# EasyEDA Pro project ProPrj_#第九届立创电赛#粮食水分仪_2024-10-15.epro

# Schematic 粮食水分仪主板
Board Name: 粮食水分仪主板; Create Date: 2024-09-28; Page Name: eeeeee; Project Name: #第九届立创电赛#粮食水分仪; Schematic Name: 粮食水分仪主板; Update Date: 2024-09-28; Company: 嘉立创EDA; Page Size: A2; Version: V1.0
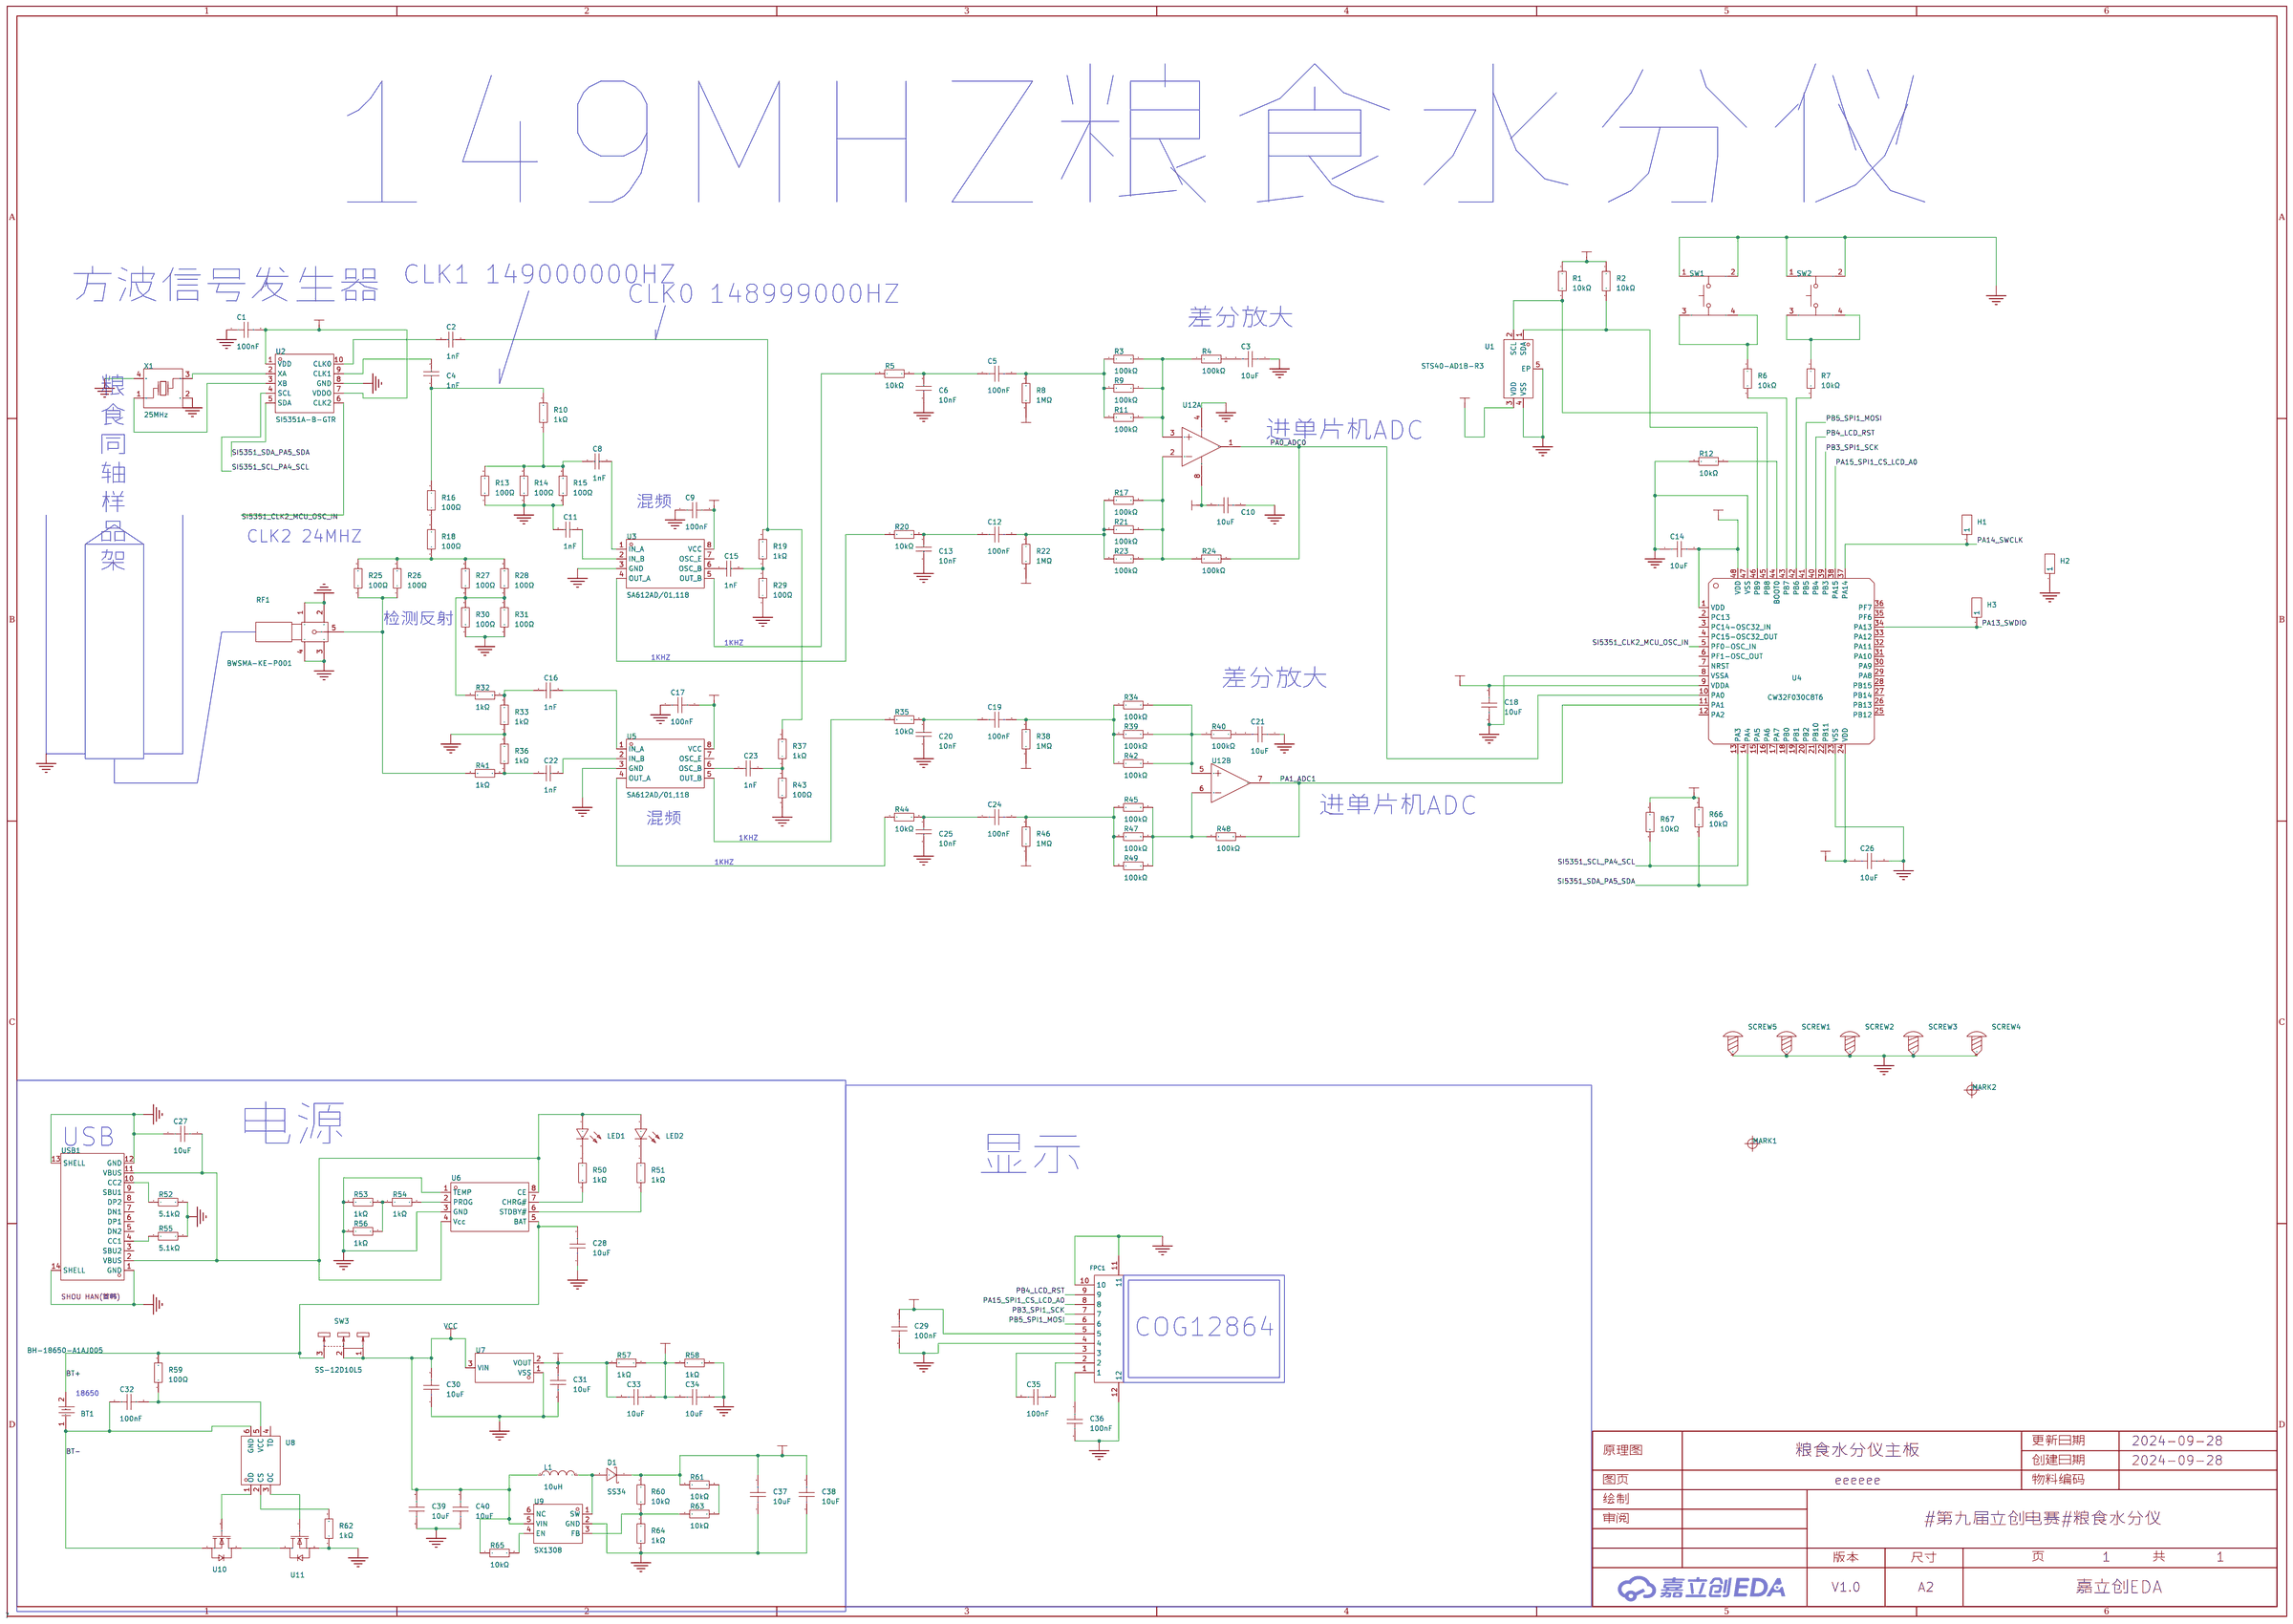
[diagram p0: schematic sheet]

## Parts
BT1  BH-18650-A1AJ005  [BAT-TH_BH-18650-A1AJ005]
C1  100nF  [C0603]
C2  1nF  [C0603]
C3  10uF  [C0603]
C4  1nF  [C0603]
C5  100nF  [C0603]
C6  10nF  [C0603]
C8  1nF  [C0603]
C9  100nF  [C0603]
C10  10uF  [C0603]
C11  1nF  [C0603]
C12  100nF  [C0603]
C13  10nF  [C0603]
C14  10uF  [C0603]
C15  1nF  [C0603]
C16  1nF  [C0603]
C17  100nF  [C0603]
C18  10uF  [C0603]
C19  100nF  [C0603]
C20  10nF  [C0603]
C21  10uF  [C0603]
C22  1nF  [C0603]
C23  1nF  [C0603]
C24  100nF  [C0603]
C25  10nF  [C0603]
C26  10uF  [C0603]
C27  10uF  [C0603]
C28  10uF  [C0603]
C29  100nF  [C0603]
C30  10uF  [C0603]
C31  10uF  [C0603]
C32  100nF  [C0603]
C33  10uF  [C0603]
C34  10uF  [C0603]
C35  100nF  [C0603]
C36  100nF  [C0603]
C37  10uF  [C0603]
C38  10uF  [C0603]
C39  10uF  [C0603]
C40  10uF  [C0603]
D1  SS34  [SMA_L4.3-W2.6-LS5.2-RD]
FPC1  -  [FPC-SMD_10P-P1.0_FGS-XJ-H2.0]
H1  -  [HDR-TH_1P-V-M_XKB_X4611WV-01I-C28D40]
H2  -  [HDR-TH_1P-V-M_XKB_X4611WV-01I-C28D40]
H3  -  [HDR-TH_1P-V-M_XKB_X4611WV-01I-C28D40]
L1  10uH  [IND-SMD_L6.0-W6.0_SWPA6045S]
LED1  204-10SURD/S530-A3-L  [LED-TH_BD3.0-P2.54-FD]
LED2  204-10SURD/S530-A3-L  [LED-TH_BD3.0-P2.54-FD]
MARK1  -  [Mark-Point-1mm]  (no BOM)
MARK2  -  [Mark-Point-1mm]  (no BOM)
R1  10kΩ  [R0603]
R2  10kΩ  [R0603]
R3  100kΩ  [R0603]
R4  100kΩ  [R0603]
R5  10kΩ  [R0603]
R6  10kΩ  [R0603]
R7  10kΩ  [R0603]
R8  1MΩ  [R0603]
R9  100kΩ  [R0603]
R10  1kΩ  [R0603]
R11  100kΩ  [R0603]
R12  10kΩ  [R0603]
R13  100Ω  [R0603]
R14  100Ω  [R0603]
R15  100Ω  [R0603]
R16  100Ω  [R0603]
R17  100kΩ  [R0603]
R18  100Ω  [R0603]
R19  1kΩ  [R0603]
R20  10kΩ  [R0603]
R21  100kΩ  [R0603]
R22  1MΩ  [R0603]
R23  100kΩ  [R0603]
R24  100kΩ  [R0603]
R25  100Ω  [R0603]
R26  100Ω  [R0603]
R27  100Ω  [R0603]
R28  100Ω  [R0603]
R29  100Ω  [R0603]
R30  100Ω  [R0603]
R31  100Ω  [R0603]
R32  1kΩ  [R0603]
R33  1kΩ  [R0603]
R34  100kΩ  [R0603]
R35  10kΩ  [R0603]
R36  1kΩ  [R0603]
R37  1kΩ  [R0603]
R38  1MΩ  [R0603]
R39  100kΩ  [R0603]
R40  100kΩ  [R0603]
R41  1kΩ  [R0603]
R42  100kΩ  [R0603]
R43  100Ω  [R0603]
R44  10kΩ  [R0603]
R45  100kΩ  [R0603]
R46  1MΩ  [R0603]
R47  100kΩ  [R0603]
R48  100kΩ  [R0603]
R49  100kΩ  [R0603]
R50  1kΩ  [R0603]
R51  1kΩ  [R0603]
R52  5.1kΩ  [R0603]
R53  1kΩ  [R0603]
R54  1kΩ  [R0603]
R55  5.1kΩ  [R0603]
R56  1kΩ  [R0603]
R57  1kΩ  [R0603]
R58  1kΩ  [R0603]
R59  100Ω  [R0603]
R60  10kΩ  [R0603]
R61  10kΩ  [R0603]
R62  1kΩ  [R0603]
R63  10kΩ  [R0603]
R64  1kΩ  [R0603]
R65  10kΩ  [R0603]
R66  10kΩ  [R0603]
R67  10kΩ  [R0603]
RF1  BWSMA-KE-P001  [SMA-SMD_BWSMA-KE-P001]
SCREW1  -  [M3螺丝]
SCREW2  -  [M3螺丝]
SCREW3  -  [M3螺丝]
SCREW4  -  [M3螺丝]
SCREW5  -  [M3螺丝]
SW1  -  [SW-TH_4P-L6.0-W6.0-P3.90-LS6.5]
SW2  -  [SW-TH_4P-L6.0-W6.0-P3.90-LS6.5]
SW3  SS-12D10L5  [SW-TH_SS-12D10L5]
U1  STS40-AD1B-R3  [DFN-4_L1.5-W1.5-P0.8-TL-EP]
U2  SI5351A-B-GTR  [MSOP-10_L3.0-W3.0-P0.50-LS5.0-BL]
U3  SA612AD/01,118  [SO-8_L4.9-W3.9-P1.27-LS5.9-BL]
U4  CW32F030C8T6  [LQFP-48_L7.0-W7.0-P0.50-LS9.0-TL]
U5  SA612AD/01,118  [SO-8_L4.9-W3.9-P1.27-LS5.9-BL]
U6  WSP4056  [SOP-8_L5.1-W3.9-P1.27-LS6.0-BL]
U7  662K.  [SOT-23-3_L2.9-W1.3-P1.90-LS2.4-BR]
U8  WSTDW01  [SOT-23-6_L2.9-W1.6-P0.95-LS2.8-BR]
U9  SX1308  [SOT-23-6_L2.9-W1.6-P0.95-LS2.8-BL]
U10  AO3400A  [SOT-23-3_L3.0-W1.6-P1.90-LS2.8-BR]
U11  AO3400A  [SOT-23-3_L3.0-W1.6-P1.90-LS2.8-BR]
U12  -  [SOP-8_L4.9-W3.9-P1.27-LS6.0-BL]  (sections 1,2)
USB1  TYPE-C16PIN2MD(073)  [USB-C-SMD_TYPE-C-6PIN-2MD-073]
X1  25MHz  [CRYSTAL-SMD_4P-L3.2-W2.5-BL]

## Library data of the parts
BT1 = BH-18650-A1AJ005: 连接器类型:电池盒;适用电池规格:CR18650;触点电镀:镍;工作温度范围:-10℃~+100℃;; LCSC Part Name: 电池盒 适用电池:CR18650; Supplier Part: C5290176; Manufacturer: MYOUNG(美阳); JLCPCB Part Class: 扩展库; Datasheet: https://atta.szlcsc.com/upload/public/pdf/source/20221129/D0CEC1B107B5F52E469FD9B49033E00F.pdf; Supplier: LCSC; Connector Type: 电池盒; Battery Type: CR18650; Contact Plating: 镍; Operating Temperature Range: -10℃~+100℃
C1 C5 C9 C12 C17 C19 C24 C29 C32 C35 C36 = CC0603KRX7R9BB104: 容值:100nF;精度:±10%;额定电压:50V;材质(温度系数):X7R;; LCSC Part Name: 100nF±10%50V; Supplier Part: C14663; Manufacturer: YAGEO(国巨); Supplier Footprint: 0603; JLCPCB Part Class: BasicPart; Datasheet: https://atta.szlcsc.com/upload/public/pdf/source/20180910/C282072_33301C7F631E79921B82A8DAC6BCC5B3.pdf; Supplier: LCSC; Tolerance: ±10%; Voltage Rated: 50V; Temperature Coefficient: X7R
C2 C4 C8 C11 C15 C16 C22 C23 = CC0603JRNPO9BN102: 容值:1nF;精度:±5%;额定电压:50V;材质(温度系数):NP0;; LCSC Part Name: 1nF±5%50V; Supplier Part: C106246; Manufacturer: YAGEO(国巨); Supplier Footprint: 0603; JLCPCB Part Class: ExtendedPart; Datasheet: https://atta.szlcsc.com/upload/public/pdf/source/20170505/1493957838062.pdf; Supplier: LCSC; Tolerance: ±5%; Voltage Rated: 50V; Temperature Coefficient: NP0
C3 C10 C14 C18 C21 C26-C28 C30 C31 C33 C34 C37-C40 = CL10A106KP8NNNC: 容值:10uF;精度:±10%;额定电压:10V;材质(温度系数):X5R;; LCSC Part Name: 10uF±10%10V; Supplier Part: C19702; Manufacturer: SAMSUNG(三星); Supplier Footprint: 0603; JLCPCB Part Class: BasicPart; Datasheet: https://atta.szlcsc.com/upload/public/pdf/source/20160103/1457707703378.pdf; Supplier: LCSC; Tolerance: ±10%; Voltage Rated: 10V; Temperature Coefficient: X5R
C6 C13 C20 C25 = CC0603KRX7R9BB103: 容值:10nF;精度:±10%;额定电压:50V;材质(温度系数):X7R;; LCSC Part Name: 10nF ±10% 50V; Supplier Part: C100042; Manufacturer: YAGEO(国巨); Supplier Footprint: 0603; JLCPCB Part Class: 扩展库; Datasheet: https://atta.szlcsc.com/upload/public/pdf/source/20181008/C309510_22F155564471FAF6A489F7D68F34234E.pdf; Supplier: LCSC; Tolerance: ±10%; Voltage Rated: 50V; Temperature Coefficient: X7R
D1 = SS34_C8678: 二极管配置:独立式;正向压降(Vf):550mV@3A;直流反向耐压(Vr):40V;整流电流:3A;; LCSC Part Name: 电压:40V 电流:3A; Supplier Part: C8678; Manufacturer: MDD(辰达半导体); Supplier Footprint: SMA(DO-214AC); JLCPCB Part Class: 基础库; Datasheet: https://atta.szlcsc.com/upload/public/pdf/source/20230314/A80AE34493C69B89E2F4B1712F433538.pdf; Supplier: LCSC; Diode Configuration: 独立式; Forward Voltage (Vf@If): 550mV@3A; Reverse Voltage (Vr): 40V; Rectified Current: 3A; Reverse Leakage Current (Ir): 500uA@40V
FPC1 = AFA01-S10FCA-00: 间距:1mm;触点数量:10;锁定特性:翻盖式;安装类型:卧贴;触点类型:下接;; LCSC Part Name: FPC1.0MM10P翻盖式H2.0mm下接; Supplier Part: C262756; Manufacturer: JS(钜硕电子); Supplier Footprint: P=1mm; JLCPCB Part Class: ExtendedPart; Supplier: LCSC; Pitch: 1mm; Number of Contacts: 10; Locking Feature: 翻盖式; Mounting Type: 卧贴; Contact Type: 下接; Height Above Board: 2mm; FFC, FCB Thickness: 0.3mm~0.3mm
H1-H3 = HDR-M_2.54_1x1P: Supplier Part: C81276; Supplier Footprint: 插件; JLCPCB Part Class: ExtendedPart
L1 = SWPA6045S100MT: 电感值:10uH;精度:±20%;额定电流:2.45A;饱和电流(Isat):3.5A;类型:-;; LCSC Part Name: 10uH ±20% 3.5A; Supplier Part: C79272; Manufacturer: Sunlord(顺络); Supplier Footprint: SMD; JLCPCB Part Class: 扩展库; Datasheet: https://atta.szlcsc.com/upload/public/pdf/source/20231024/317626D2AA2F8AB4113C1875E432E6E1.pdf; Supplier: LCSC; Tolerance: ±20%; Rated Current: 2.45A; Saturation Current (Isat): 3.5A; DC Resistance (DCR): 48mΩ
LED1 LED2 = 204-10SURD/S530-A3-L: 发光颜色:红灯;二极管配置:-;主波长:624nm;色温:-;功率:60mW;安装方式:-;; LCSC Part Name: 红灯; Supplier Part: C99771; Manufacturer: EVERLIGHT(亿光); Supplier Footprint: 插件,D=3mm; JLCPCB Part Class: ExtendedPart; Datasheet: https://atta.szlcsc.com/upload/public/pdf/source/20170504/1493866972127.pdf; Supplier: LCSC; Emitted Color: 红灯; Lens Color: 雾状红; Dominant Wavelength: 624nm; Peak Wavelength: 632nm; Forward Current: 20mA; Power Dissipation: 60mW; Viewing Angle: 40°; Operating Temperature: -40℃~+85℃; Lamp Holder Type: 3mm圆形灯头
MARK1 MARK2 = Mark-Point: Mark点
R1 R2 R5-R7 R12 R20 R35 R44 R52 R55 R60 R61 R63 R65-R67 = RC0603FR-0710KL: 电阻类型:厚膜电阻;阻值:10kΩ;精度:±1%;功率:100mW;; LCSC Part Name: 10kΩ±1%100mW; Supplier Part: C98220; Manufacturer: YAGEO(国巨); Supplier Footprint: 0603; JLCPCB Part Class: ExtendedPart; Datasheet: https://atta.szlcsc.com/upload/public/pdf/source/20170522/1495423494387.pdf; Supplier: LCSC; Type: 厚膜电阻; Tolerance: ±1%; Power(Watts): 100mW; Temperature Coefficient: ±100ppm/℃; Overload Voltage (Max): 75V; Operating Temperature Range: -55℃~+155℃
R3 R4 R9 R11 R17 R21 R23 R24 R34 R39 R40 R42 R45 R47-R49 = RC0603FR-07100KL: 电阻类型:厚膜电阻;阻值:100kΩ;精度:±1%;功率:100mW;; LCSC Part Name: 100kΩ±1%100mW; Supplier Part: C14675; Manufacturer: YAGEO(国巨); Supplier Footprint: 0603; JLCPCB Part Class: ExtendedPart; Datasheet: https://atta.szlcsc.com/upload/public/pdf/source/20140324/1457707028752.pdf; Supplier: LCSC; Type: 厚膜电阻; Tolerance: ±1%; Power(Watts): 100mW; Temperature Coefficient: ±100ppm/℃; Overload Voltage (Max): 75V; Operating Temperature Range: -55℃~+155℃
R8 R22 R38 R46 = 0603WAF1004T5E: 电阻类型:厚膜电阻;阻值:1MΩ;精度:±1%;功率:100mW;; LCSC Part Name: 1MΩ±1%100mW; Supplier Part: C22935; Manufacturer: UNI-ROYAL(厚声); Supplier Footprint: 0603; JLCPCB Part Class: BasicPart; Datasheet: https://atta.szlcsc.com/upload/public/pdf/source/20200306/C422600_1E6D84923E4A46A82E41ADD87F860B5C.pdf; Supplier: LCSC; Type: 厚膜电阻; Tolerance: ±1%; Power(Watts): 100mW; Temperature Coefficient: ±100ppm/℃; Overload Voltage (Max): 75V; Operating Temperature Range: -55℃~+155℃
R10 R19 R32 R33 R36 R37 R41 R50 R51 R53 R54 R56-R58 R62 R64 = RC0603FR-071KL: 电阻类型:厚膜电阻;阻值:1kΩ;精度:±1%;功率:100mW;; LCSC Part Name: 1kΩ±1%100mW; Supplier Part: C22548; Manufacturer: YAGEO(国巨); Supplier Footprint: 0603; JLCPCB Part Class: ExtendedPart; Datasheet: https://atta.szlcsc.com/upload/public/pdf/source/20180312/7BD3618A8B6324EA6280B0497A051AB7.pdf; Supplier: LCSC; Type: 厚膜电阻; Tolerance: ±1%; Power(Watts): 100mW; Temperature Coefficient: ±100ppm/℃; Overload Voltage (Max): 75V; Operating Temperature Range: -55℃~+155℃
R13-R16 R18 R25-R31 R43 R59 = RC0603FR-07100RL: 电阻类型:厚膜电阻;阻值:100Ω;精度:±1%;功率:100mW;; LCSC Part Name: 100Ω±1%100mW; Supplier Part: C105588; Manufacturer: YAGEO(国巨); Supplier Footprint: 0603; JLCPCB Part Class: ExtendedPart; Datasheet: https://atta.szlcsc.com/upload/public/pdf/source/20170428/1493376742308.pdf; Supplier: LCSC; Type: 厚膜电阻; Tolerance: ±1%; Power(Watts): 100mW; Temperature Coefficient: ±100ppm/℃; Overload Voltage (Max): 75V; Operating Temperature Range: -55℃~+155℃
RF1 = BWSMA-KE-P001: 连接器类型:板端;接口类型:内孔;端口数量:1;接口直径:5.2mm;接口长度/高度:-;频率-最大值:-;射频系列:SMA;阻抗:50Ω;样式:偏脚;工作温度范围:-;; LCSC Part Name: 内孔 SMA 偏脚; Supplier Part: C496550; Manufacturer: BAT WIRELESS(蝙蝠无线); Supplier Footprint: 插件; JLCPCB Part Class: 扩展库; Datasheet: https://atta.szlcsc.com/upload/public/pdf/source/20240320/28FD502871C976DFF213ABFCF2A0ED51.pdf; Supplier: LCSC; Connector Type: 板端; Interface Type: 内孔; Number of Ports: 1; Interface Diameter: 5.2mm; RF Series: SMA; Impedance: 50Ω; Style: 偏脚
SCREW1-SCREW5 = M3螺丝: Supplier Footprint: 插件
SW1 SW2 = 1TS005A-2500-5001: 触点电流:50mA;额定电压(DC):12V;额定功率:0.6W;绝缘电阻:100MΩ;电路结构:单刀单掷;安装方式:直插;带灯:无;作用力:250gf@±50gf;机械寿命:7万次;带支架:否;; LCSC Part Name: 6*6*5mm直插轻触开关; Supplier Part: C255811; Manufacturer: HYP(鸿源精密); Supplier Footprint: 插件,6x6mm; JLCPCB Part Class: ExtendedPart; Datasheet: https://atta.szlcsc.com/upload/public/pdf/source/20180720/C255811_DA12C4E3C20854D48E888AEA64926F5F.pdf; Supplier: LCSC; Contact Current: 50mA; Voltage Rating (DC): 12V; Power Rating: 0.6W; Insulation Resistance: 100MΩ; Circuit: 单刀单掷; Mounting Style: 直插; Actuator Style: 圆形按钮; Actuator/Cap Color: 黑色; With Lamp: 无; Operating Force: 250gf@±50gf; Mechanical Life: 7万次; Operating Temperature: -40℃~+90℃; Pin Style: PC引脚; Switch Length: 6mm; Switch Width: 6mm; Switch Height: 5mm; Strike Gundam: 否
SW3 = SS-12D10L5: 电路结构:单刀双掷;安装方式:直插;开关颜色:黑色;额定电流(DC):3A;额定电压(DC):125V;额定电流(AC):3A;额定电压(AC):125V;机械寿命:1万次;; LCSC Part Name: 柄长5mm 直插双档 滑动开关; Supplier Part: C319012; Manufacturer: XKB Connectivity(中国星坤); Supplier Footprint: 插件; JLCPCB Part Class: 扩展库; Datasheet: https://atta.szlcsc.com/upload/public/pdf/source/20211009/D6412F37AABE6F9459A6EE7FA4DAEADB.pdf; Supplier: LCSC; Circuit: 单刀双掷; Actuator Style: 矩形柱状; Pin Style: PC引脚; Switch Length: 13mm; Switch Width: 6.8mm; Switch Height: 6.4mm; Mounting Style: 直插; Actuator Color: 黑色; Current Rating (DC): 3A; Voltage Rating (DC): 125V; Current Rating (AC): 3A; Voltage Rating (AC): 125V; Mechanical Life: 1万次; Operating Temperature: -40℃~+85℃
U1 = STS40-AD1B-R3: ±0.2°C 数字温度传感器; LCSC Part Name: 3.000.781; Supplier Part: C3663715; Manufacturer: Sensirion(瑞士盛思锐); Supplier Footprint: DFN-4(1.5x1.5); JLCPCB Part Class: 扩展库; Supplier: LCSC; Supply Voltage: 1.08V~3.6V
U2 = SI5351A-B-GTR: 接口类型:I2C;最大输出频率:200MHz;; Supplier Part: C504891; Manufacturer: SKYWORKS/SILICON LABS(芯科); Supplier Footprint: MSOP-10; JLCPCB Part Class: 扩展库; Datasheet: https://atta.szlcsc.com/upload/public/pdf/source/20201217/C504891_43D9F8D26F790B9DA481E85A362B0988.pdf; Supplier: LCSC; Interface: I2C; Output Frequency (Max): 200MHz; Supply Voltage: 2.25V~3.6V; Input Low Voltage: 990mV; Intput High Voltage: 1.75V~3.6V; Output Low Voltage: 600mV; Output High Voltage: 1.9V; Operating Temperatue: -55℃~+150℃
U3 U5 = SA612AD/01,118: 应用领域:手机,HF,VHF;频率范围:500MHz;增益:17dB;噪声系数:5dB;; Supplier Part: C2688063; Manufacturer: NXP(恩智浦); Supplier Footprint: SO-8; JLCPCB Part Class: 扩展库; Datasheet: https://atta.szlcsc.com/upload/public/pdf/source/20210226/C2688063_620DC9371BFBB8DBB804BB871760779B.pdf; Supplier: LCSC; Applications: 手机,HF,VHF; Frequency Range: 500MHz; Gain: 17dB; Noise Figure: 5dB; Supply Voltage: 4.5V~8V; Supply Current: 2.4mA
U4 = CW32F030C8T6_C3019113: CPU内核:ARM Cortex-M0+;CPU最大主频:64MHz;工作电压范围:1.65V~5.5V;内部振荡器:有;外部时钟频率范围:4MHz~32MHz;程序 FLASH容量:-;RAM总容量:8KB;EEPROM/数据 FLASH容量:-;GPIO端口数量:39;ADC(单元数/通道数/位数):1@x16ch/12bit;DAC(单元数/通道数/位数):-;(E)PWM(单元数/通道数/位数):-;8位Timer数量:-;16位Timer数量:8;32位Timer数量:-;内部比较器数量:2;U; LCSC Part Name: ARMCortex-M0+64MHzRAM：8KB; Supplier Part: C3019113; Manufacturer: CW(芯源); Supplier Footprint: LQFP-48; JLCPCB Part Class: ExtendedPart; Datasheet: https://atta.szlcsc.com/upload/public/pdf/source/20220516/D60F5E1023A73FFF550D4A77416DDFBC.pdf; Supplier: LCSC; CPU Core: ARMCortex-M0+; Maximum Frequency: 64MHz; Supply Voltage Range: 1.65V~5.5V; Internal Oscillator: 有; External Clock Frequency Rang: 4MHz~32MHz; RAM Size: 8KB; GPIO Ports Number: 39; ADC (Units/Channels/bits): 1@x16ch/12bit; 16Bit Timer Number: 8; CMP Number: 2; U(S)ART Number: 3; I2C Number: 2; (Q)SPI Number: 2; Peripherals / Functions / Protocol Stacks: 片载温度传感器；DMA；看门狗；低电压检测；CRC校验; Operating Temperature Range: -40℃~105℃
U6 = WSP4056: Supplier Part: C2985892; Manufacturer: WINSOK(微硕); Supplier Footprint: SOP-8; JLCPCB Part Class: ExtendedPart; Supplier: LCSC
U7 = 662K.: 输出类型:-;; LCSC Part Name: 662K; Supplier Part: C841298; Manufacturer: FM(富满); Supplier Footprint: SOT23-3; JLCPCB Part Class: ExtendedPart; Datasheet: https://atta.szlcsc.com/upload/public/pdf/watermark/20200922/C841298_3E220732626B158CD6AC195AF78C7FB8.pdf; Supplier: LCSC
U8 = WSTDW01: 充电电池的类型:-;电池单元组数:-;最大充电电流:-;充满的电池组电压:-;最大供应电压:-;; Supplier Part: C86873; Manufacturer: WINSOK(微硕); Supplier Footprint: SOT-23-6; JLCPCB Part Class: ExtendedPart; Datasheet: https://atta.szlcsc.com/upload/public/pdf/source/20161110/1478743415995.pdf; Supplier: LCSC
U9 = SX1308: 功能类型:升压型;输入电压:2V~24V;输出电压:28V;输出电流(最大值):-;; Supplier Part: C78162; Manufacturer: SX(硕芯科技); Supplier Footprint: SOT-23-6; JLCPCB Part Class: 扩展库; Datasheet: https://atta.szlcsc.com/upload/public/pdf/source/20160920/1474356679185.pdf; Supplier: LCSC; Function: 升压型; Input Voltage: 2V~24V; Output Voltage: 28V; Switching Frequency: 1.2MHz; Synchronous Rectification: 否; Number of Outputs: 1; Topology: 升压式; Switch tube (built-in/external): 内置
U10 U11 = AO3400A_C5224194: 类型:N沟道;漏源电压(Vdss):30V;连续漏极电流(Id):6A;功率(Pd):1.4W;导通电阻(RDS(on)@Vgs,Id):19mΩ@10V,6.0A;; LCSC Part Name: N沟道30V6A; Supplier Part: C5224194; Manufacturer: ElecSuper(静芯微）; Supplier Footprint: SOT-23-3L; JLCPCB Part Class: ExtendedPart; Datasheet: https://atta.szlcsc.com/upload/public/pdf/source/20221027/D95D9171DDBB7BB324532F3AF1EADB7E.pdf; Supplier: LCSC; Type: N沟道; Drain Source Voltage (Vdss): 30V; Continuous Drain Current (Id): 6A; Power Dissipation (Pd): 1.4W; Drain Source On Resistance (RDS(on)@Vgs,Id): 19mΩ@10V,6.0A; Gate Threshold Voltage (Vgs(th)@Id): 1V@250uA
U12 = LMV358ARZ: CMOS低功耗双路运算放大器; Supplier Part: C2928823; Manufacturer: HTCSEMI(海天芯); Supplier Footprint: SOP-8; JLCPCB Part Class: ExtendedPart; Datasheet: https://atta.szlcsc.com/upload/public/pdf/source/20220114/2D4B849A76DE33264688A93B3A90A0F8.pdf; Supplier: LCSC
USB1 = TYPE-C 16PIN 2MD(073): 连接器类型:Type-C;标准:-;公母:母座;触点数量:16;端口数量:1;安装方式:卧贴;额定电流 - 电源:5A;工作温度范围:-25℃~+85℃;; LCSC Part Name: TYPE-C母座16P4脚插件带定位柱不锈钢外壳2次模顶; Supplier Part: C2765186; Manufacturer: SHOU HAN(首韩); Supplier Footprint: SMD; JLCPCB Part Class: ExtendedPart; Datasheet: https://atta.szlcsc.com/upload/public/pdf/source/20211123/39B17C16241EAC15C5E277BDA434118E.pdf; Supplier: LCSC; Connector Type: Type-C; Gender: 母座; Number of Contacts: 16; Number of Ports: 1; Mounting Style: 卧贴; Current Rating - Power (Max): 5A; Operating Temperature Range: -25℃~+85℃
X1 = X322525MMB4SI: 晶振类型:贴片晶振;频率:25MHz;常温频差:±10ppm;外接负载电容:10pF;频率稳定度(全温):±20ppm;; LCSC Part Name: 25MHz ±10ppm 10pF; Supplier Part: C70582; Manufacturer: YXC(扬兴晶振); Supplier Footprint: SMD3225-4P; JLCPCB Part Class: 扩展库; Datasheet: https://atta.szlcsc.com/upload/public/pdf/source/20240329/19D5F850207469550BEB00D7DFEDBC7A.pdf; Supplier: LCSC; Crystal Type: 贴片晶振; Normal temperature Frequency Tolerance: ±10ppm; External load capacitor: 10pF; Frequency Stability(Full temperature range): ±20ppm; Operating Temperature: -40℃~+85℃

## Nets
+1.65V: C33.1 C34.2 R8.1 R22.1 R38.1 R46.1 R57.2 R58.1
+3.3V: C1.2 C10.2 C14.2 C18.2 C26.1 C29.1 C31.2 C33.2 FPC1.5 R1.1 R2.1 R57.1 R66.1 R67.1 U1.3(VDD) U2.1(VDD) U2.7(VDDO) U4.1(VDD) U4.9(VDDA) U4.24(VDD) U4.48(VDD) U7.2(VOUT) U12.8(VCC)
+4.5V: C9.2 C17.2 C37.2 C38.2 D1.1(K) R60.1 R61.1 U3.8(VCC) U5.8(VCC)
GND: C1.1 C3.1 C6.1 C9.1 C10.1 C11.1 C13.1 C14.1 C17.1 C18.1 C20.1 C21.1 C25.1 C26.2 C27.1 C28.1 C29.2 C30.1 C31.1 C34.1 C36.2 C37.1 C38.1 C39.1 C40.1 FPC1.4 FPC1.10 FPC1.11 FPC1.12 H2.1 R12.2 R13.1 R14.1 R15.1 R29.1 R30.1 R31.1 R33.1 R36.1 R43.1 R52.2 R53.2 R55.2 R56.2 R58.2 R62.1 R64.2 RF1.1 RF1.2 RF1.3 RF1.4 SCREW1.1 SCREW2.1 SCREW3.1 SCREW4.1 SCREW5.1 SW1.1 SW1.2 SW2.1 SW2.2 U1.4(VSS) U1.5(EP) U2.8(GND) U3.3(GND) U4.8(VSSA) U4.23(VSS) U4.47(VSS) U5.3(GND) U6.1(TEMP) U6.3(GND) U7.1(VSS) U9.2(GND) U11.2(S) U12.4(GND) USB1.1(GND) USB1.12(GND) USB1.13(SHELL) USB1.14(SHELL) X1.2(GND) X1.4(GND)
VCC: C30.2 C39.2 C40.2 L1.2 R65.1 SW3.1 SW3.2 U7.3(VIN) U9.5(VIN)
BT+: BT1.2 C28.2 R59.2 SW3.3 U6.5(BAT)
BT-: BT1.1 C32.1 U8.6(GND) U10.2(S)
PA0_ADC0: R24.2 U4.10(PA0) U12.1(OUT)
PA1_ADC1: R48.2 U4.11(PA1) U12.7(OUT2)
PA13_SWDIO: H3.1 U4.34(PA13)
PA14_SWCLK: H1.1 U4.37(PA14)
PA15_SPI1_CS_LCD_A0: FPC1.8 U4.38(PA15)
PB3_SPI1_SCK: FPC1.7 U4.39(PB3)
PB4_LCD_RST: FPC1.9 U4.40(PB4)
PB5_SPI1_MOSI: FPC1.6 U4.41(PB5)
SI5351_CLK2_MCU_OSC_IN: U2.6(CLK2) U4.5(PF0-OSC_IN)
SI5351_SCL_PA4_SCL: R67.2 U2.4(SCL) U4.13(PA3)
SI5351_SDA_PA5_SDA: R66.2 U2.5(SDA) U4.14(PA4)
$1N13991: U10.3(D) U11.3(D)
$1N14154: U8.1(OD) U10.1(G)
$1N14198: U8.3(OC) U11.1(G)
$1N14351: R62.2 U8.2(CS)
$1N15015: R54.1 U6.2(PROG)
$1N15845: R50.1 U6.7(CHRG#)
$1N15894: R51.1 U6.6(STDBY#)
$1N16826: R55.1 USB1.4(CC1)
$1N16875: R52.1 USB1.10(CC2)
$1N19532: C32.2 R59.1 U8.5(VCC)
$1N165486: R53.1 R54.2 R56.1
$1N167672: C27.2 LED1.1(A) LED2.1(A) U6.4(Vcc) U6.8(CE) USB1.2(VBUS) USB1.11(VBUS)
$1N179497: LED1.2(K) R50.2
$1N179538: LED2.2(K) R51.2
$1N206778: R12.1 U4.44(BOOT0)
$1N234129: R6.1 SW1.3 SW1.4
$1N234138: R7.1 SW2.3 SW2.4
$1N234147: R6.2 U4.43(PB7)
$1N234151: R7.2 U4.42(PB6)
$1N252869: C36.1 FPC1.1
$1N252872: C35.2 FPC1.2
$1N252875: C35.1 FPC1.3
$1N306266: R25.1 R26.1 R41.2 RF1.5
$1N307798: R2.2 U1.1(SDA) U4.46(PB9)
$1N307806: R1.2 U1.2(SCL) U4.45(PB8)
$1N312774: R27.1 R28.1 R30.2 R31.2 R32.2
$1N315798: C16.1 R32.1 R33.2
$1N315843: C22.1 R36.2 R41.1
$1N315966: C16.2 U5.1(IN_A)
$1N315972: C22.2 U5.2(IN_B)
$1N316211: D1.2(A) L1.1 U9.1(SW)
$1N316578: R61.2 R63.2
$1N316588: R60.2 R63.1 R64.1 U9.3(FB)
$1N317006: R65.2 U9.4(EN)
$1N317029: R18.1 R25.2 R26.2 R27.2 R28.2
$1N317034: C4.2 U2.9(CLK1)
$1N317145: R16.1 R18.2
$1N317149: C4.1 R10.2 R16.2
$1N317264: C23.1 U5.6(OSC_B)
$1N317334: C23.2 R37.1 R43.2
$1N317556: C8.1 R10.1 R13.2 R14.2 R15.2
$1N317854: C8.2 U3.1(IN_A)
$1N317860: C11.2 U3.2(IN_B)
$1N318018: C15.2 R19.1 R29.2
$1N318020: C15.1 U3.6(OSC_B)
$1N318025: C2.1 R19.2 R37.2
$1N318503: R3.2 R4.1 R9.2 R11.2 U12.3(IN1+)
$1N318532: R17.2 R21.2 R23.2 R24.1 U12.2(IN1-)
$1N318560: R45.2 R47.2 R48.1 R49.2 U12.6(IN2-)
$1N318595: R34.2 R39.2 R40.1 R42.2 U12.5(IN2+)
$1N319019: C19.2 R34.1 R38.2 R39.1 R42.1
$1N319032: C24.2 R45.1 R46.2 R47.1 R49.1
$1N319066: C12.2 R17.1 R21.1 R22.2 R23.1
$1N319081: C5.2 R3.1 R8.2 R9.1 R11.1
$1N319118: C21.2 R40.2
$1N319219: C3.2 R4.2
$1N319491: C5.1 C6.2 R5.2
$1N319530: C12.1 C13.2 R20.2
$1N319569: C19.1 C20.2 R35.2
$1N319608: C24.1 C25.2 R44.2
$1N319612: R5.1 U3.5(OUT_B)
$1N319619: R20.1 U3.4(OUT_A)
$1N319627: R35.1 U5.5(OUT_B)
$1N319640: R44.1 U5.4(OUT_A)
$1N320395: U2.2(XA) X1.3(OSC2)
$1N320402: U2.3(XB) X1.1(OSC1)
$1N320534: C2.2 U2.10(CLK0)

Not connected (* = marked no-connect by the designer): MARK1 1; MARK2 1; U3 7(OSC_E); U4 2(PC13) 3(PC14-OSC32_IN) 4(PC15-OSC32_OUT) 6(PF1-OSC_OUT) 7(NRST) 12(PA2) 15(PA5) 16(PA6) 17(PA7) 18(PB0) 19(PB1) 20(PB2) 21(PB10) 22(PB11) 25(PB12) 26(PB13) 27(PB14) 28(PB15) 29(PA8) 30(PA9) 31(PA10) 32(PA11) 33(PA12) 35(PF6) 36(PF7); U5 7(OSC_E); U8 4(TD); U9 6(NC); USB1 3(SBU2) 5(DN2) 6(DP1) 7(DN1) 8(DP2) 9(SBU1)

## Notes on the sheet
- 149MHZ粮食水分仪
- CLK1 149000000HZ
- 方波信号发生器
- CLK0 148999000HZ
- 差分放大
- 进单片机ADC
- 混频
- CLK2 24MHZ
- 粮
  食
  同
  轴
  样
  品
  架
- 检测反射
- 1KHZ
- 1KHZ
- 差分放大
- 进单片机ADC
- 混频
- 1KHZ
- 1KHZ
- USB
- 电源
- 显示
- COG12864
- 18650

# Board 粮食水分仪主板
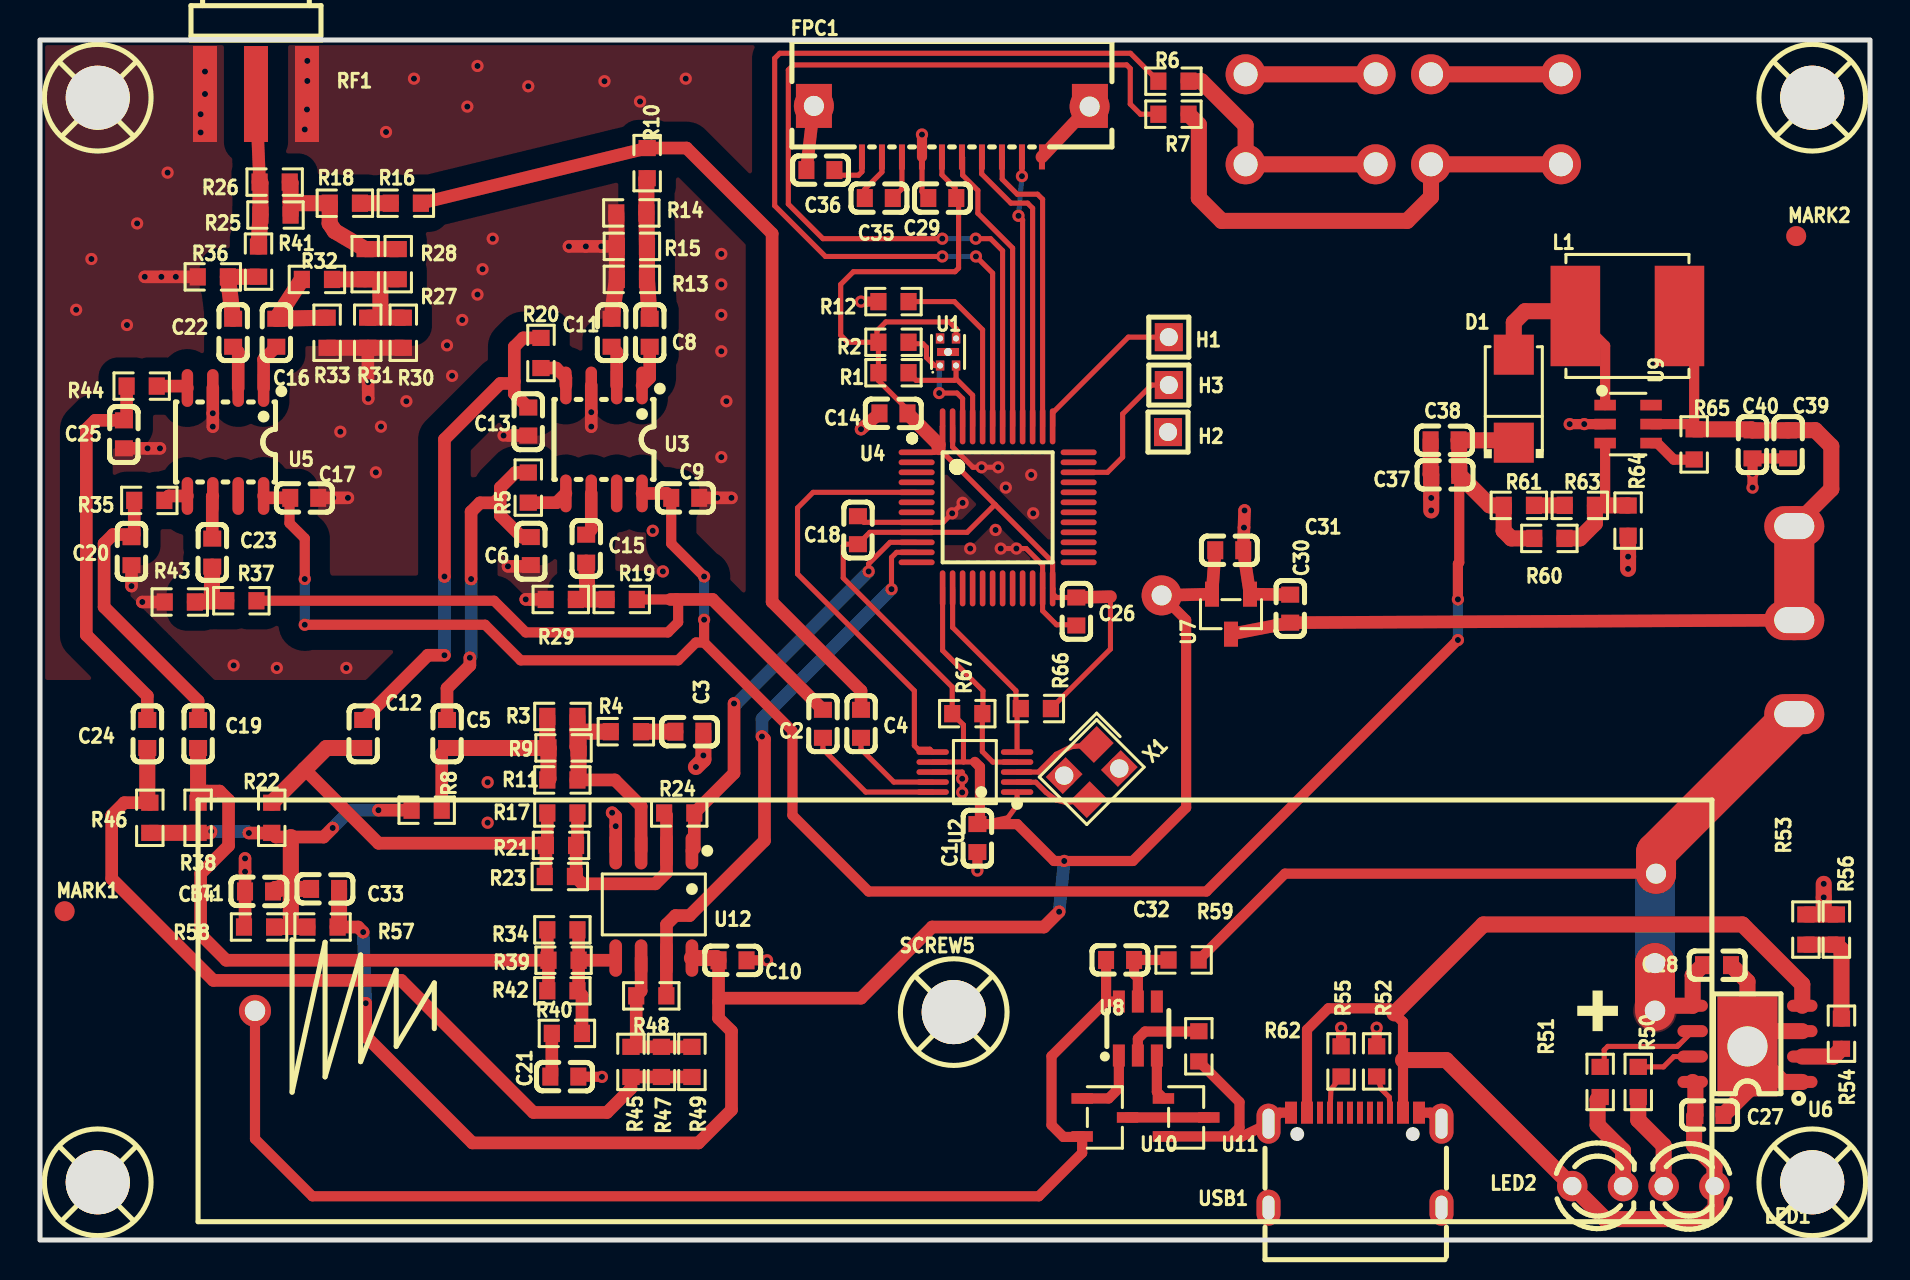
[diagram p1: board, top side]
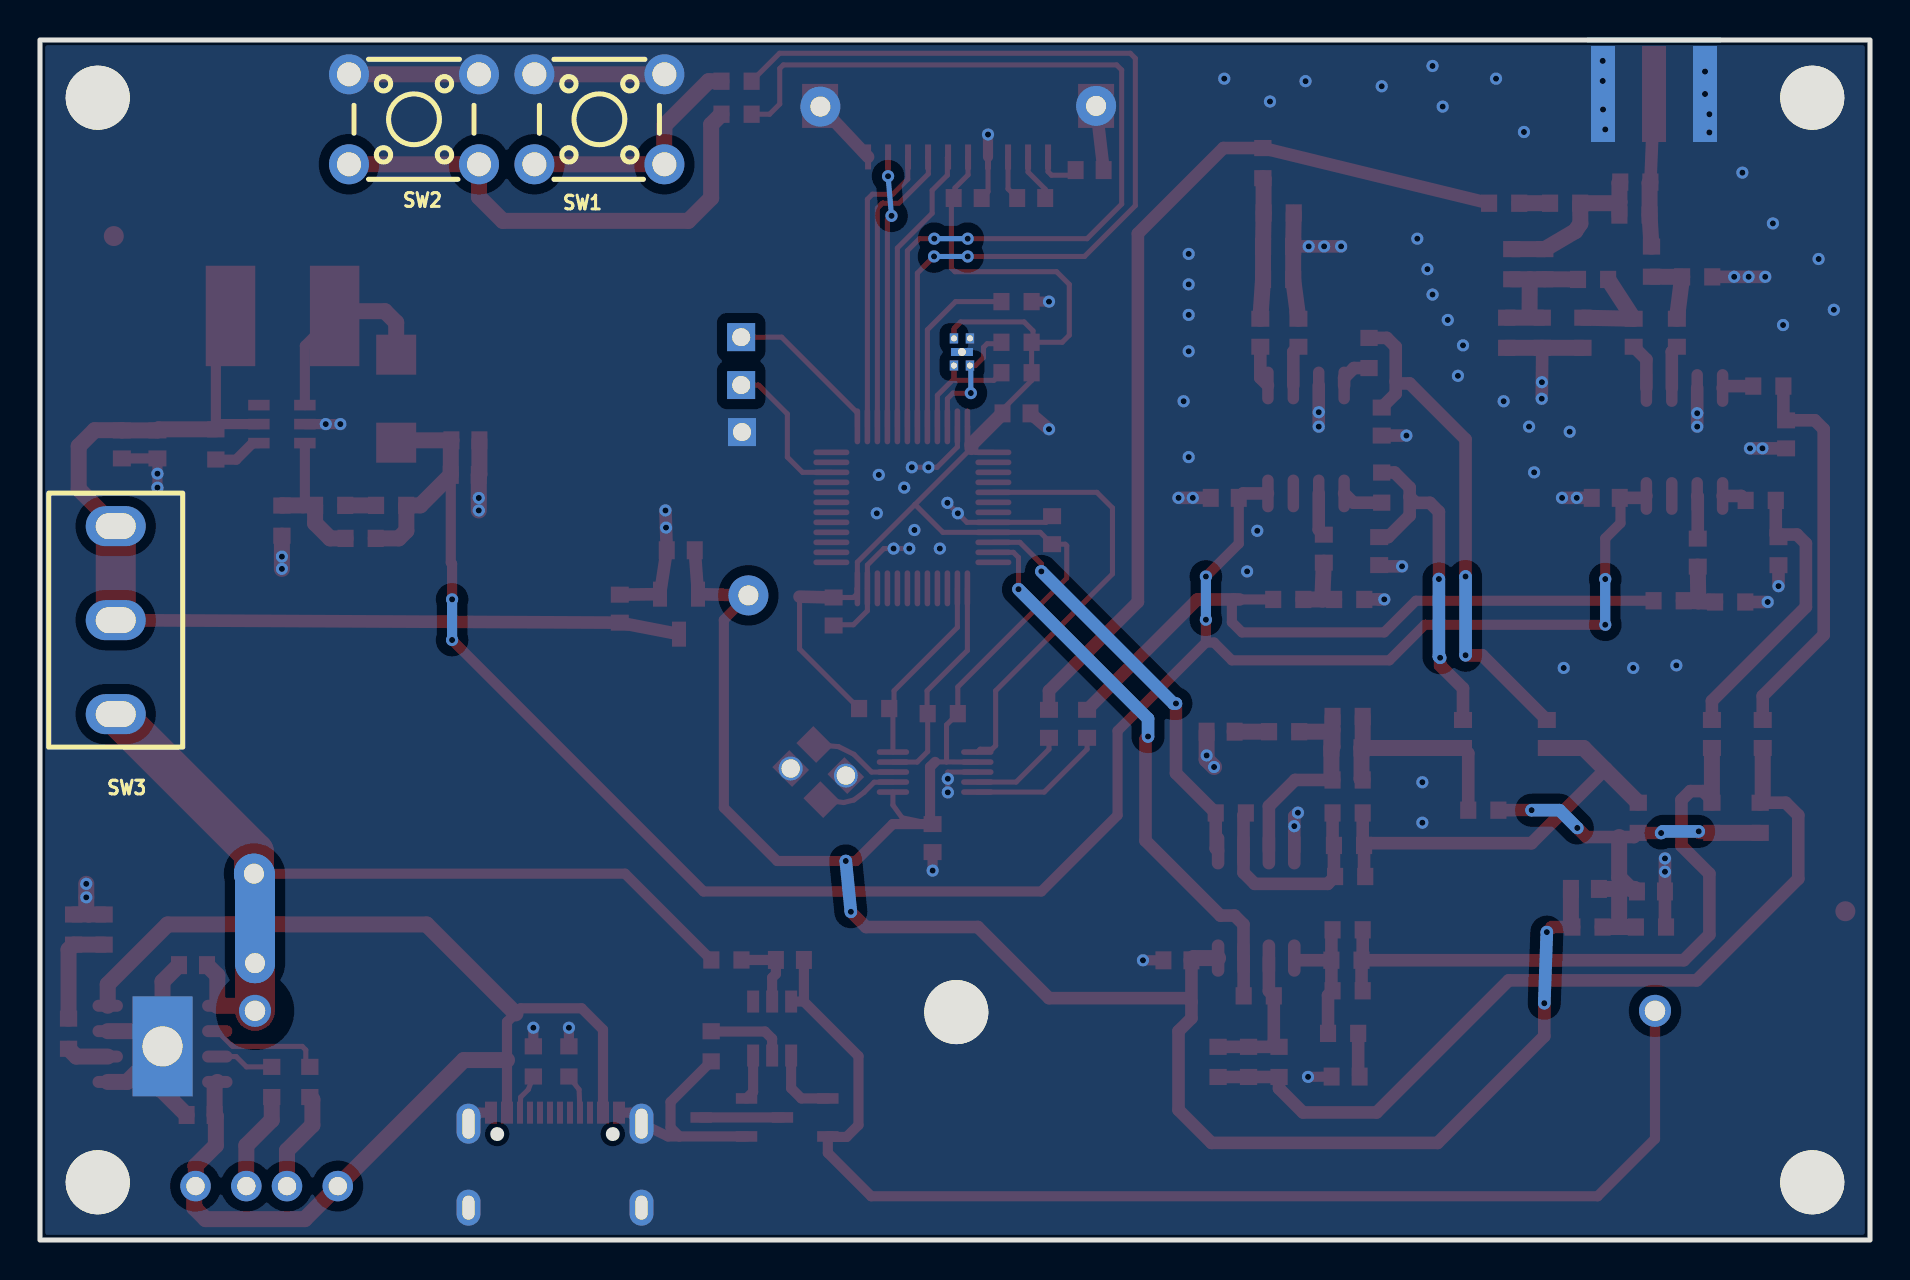
[diagram p2: board, bottom side, seen from below]

Outline 91.5 x 60 mm; copper layers: Top Layer, Bottom Layer. Coordinates in mm from the lower left corner of the outline.
Outline path: rectangle 0,60 91.5,0
Stack: Top Layer 0.035mm / Dielectric1 1.51mm FR4 er 4.5 / Bottom Layer 0.035mm

## Design rules (mm)
template: 自定义配置
spacing copperThickness1oz (default): track to track 0.102, other pairs 0.152 to 0.3
spacing copperThickness2oz: track to track 0.203, other pairs 0.152 to 0.3
track width copperThickness1oz (default): min 0.127, default 0.254, max 2.54
track width copperThickness2oz: min 0.203, default 0.254, max 2.54
differential pair differentialPair (default): width min 0.127, default 0.254, max 2.54; gap min 0.152, default 0.152
via viaSize (default): diameter min 0.5, default 0.61, max 10; hole min 0.3, default 0.305, max 6.3

## Placement (name value [footprint] x y rotation side)
BT1  BH-18650-A1AJ005  [BAT-TH_BH-18650-A1AJ005]  45.75 11.46 0 top
C1  100nF  [C0603]  46.87 20.09 90 top
C2  1nF  [C0603]  39.15 25.81 270 top
C3  10uF  [C0603]  32.47 25.41 180 top
C4  1nF  [C0603]  41.05 25.81 270 top
C5  100nF  [C0603]  20.35 25.3 270 top
C6  10nF  [C0603]  24.54 34.44 90 top
C8  1nF  [C0603]  30.48 45.36 270 top
C9  100nF  [C0603]  32.26 37.11 180 top
C10  10uF  [C0603]  34.63 13.98 180 top
C11  1nF  [C0603]  28.58 45.36 270 top
C12  100nF  [C0603]  16.16 25.3 270 top
C13  10nF  [C0603]  24.41 40.92 90 top
C14  10uF  [C0603]  42.67 41.33 0 top
C15  1nF  [C0603]  27.31 34.57 270 top
C16  1nF  [C0603]  11.81 45.36 270 top
C17  100nF  [C0603]  13.21 37.11 180 top
C18  10uF  [C0603]  40.9 35.49 270 top
C19  100nF  [C0603]  7.9 25.3 270 top
C20  10nF  [C0603]  4.58 34.44 90 top
C21  10uF  [C0603]  26.22 8.17 180 top
C22  1nF  [C0603]  9.66 45.36 270 top
C23  1nF  [C0603]  8.61 34.37 270 top
C24  100nF  [C0603]  5.36 25.3 270 top
C25  10nF  [C0603]  4.19 40.28 90 top
C26  10uF  [C0603]  51.82 31.42 270 top
C27  10uF  [C0603]  83.47 6.25 180 top
C28  10uF  [C0603]  83.85 13.74 180 top
C29  100nF  [C0603]  45.12 52.1 180 top
C30  10uF  [C0603]  62.51 31.57 270 top
C31  10uF  [C0603]  59.46 34.49 180 top
C32  100nF  [C0603]  54 14 0 top
C33  10uF  [C0603]  14.25 17.55 0 top
C34  10uF  [C0603]  10.95 17.43 0 top
C35  100nF  [C0603]  41.94 52.1 180 top
C36  100nF  [C0603]  39.02 53.49 180 top
C37  10uF  [C0603]  70.26 38.25 0 top
C38  10uF  [C0603]  70.23 39.98 0 top
C39  10uF  [C0603]  87.41 39.78 90 top
C40  10uF  [C0603]  85.63 39.78 90 top
D1  SS34  [SMA_L4.3-W2.6-LS5.2-RD]  73.69 42.06 90 top
FPC1  -  [FPC-SMD_10P-P1.0_FGS-XJ-H2.0]  45.59 55.43 0 top
H1  -  [HDR-TH_1P-V-M_XKB_X4611WV-01I-C28D40]  56.44 45.14 0 top
H2  -  [HDR-TH_1P-V-M_XKB_X4611WV-01I-C28D40]  56.4 40.4 0 top
H3  -  [HDR-TH_1P-V-M_XKB_X4611WV-01I-C28D40]  56.44 42.75 0 top
L1  10uH  [IND-SMD_L6.0-W6.0_SWPA6045S]  79.37 46.2 0 top
LED1  204-10SURD/S530-A3-L  [LED-TH_BD3.0-P2.54-FD]  82.45 2.69 180 top
LED2  204-10SURD/S530-A3-L  [LED-TH_BD3.0-P2.54-FD]  77.88 2.69 0 top
MARK1  -  [Mark-Point-1mm]  1.23 16.44 0 top
MARK2  -  [Mark-Point-1mm]  87.81 50.2 0 top
NOREF  -  [Pad_e588]  85.37 9.68 0 top
NOREF#2  -  [Pad_e248]  53.97 23.57 90 top
NOREF#3  -  [Pad_e750]  80.75 13.84 0 top
NOREF#4  -  [Pad_e1295]  56.08 32.23 0 top
NOREF#5  -  [Pad_e246]  51.21 23.22 90 top
NOREF#6  -  [Pad_e749]  80.8 18.32 0 top
NOREF#7  -  [Pad_e1581]  38.69 56.7 0 top
NOREF#8  -  [Pad_e1582]  52.48 56.67 0 top
R1  10kΩ  [R0603]  42.67 43.36 0 top
R2  10kΩ  [R0603]  42.67 44.89 0 top
R3  100kΩ  [R0603]  26.12 26.18 0 top
R4  100kΩ  [R0603]  29.29 25.41 0 top
R5  10kΩ  [R0603]  24.41 37.62 90 top
R6  10kΩ  [R0603]  56.67 57.94 180 top
R7  10kΩ  [R0603]  56.67 56.29 180 top
R8  1MΩ  [R0603]  19.33 21.49 0 top
R9  100kΩ  [R0603]  26.18 24.6 0 top
R10  1kΩ  [R0603]  30.36 53.84 90 top
R11  100kΩ  [R0603]  26.12 23 0 top
R12  10kΩ  [R0603]  42.67 46.92 180 top
R13  100Ω  [R0603]  29.59 48.03 0 top
R14  100Ω  [R0603]  29.57 51.35 0 top
R15  100Ω  [R0603]  29.59 49.68 0 top
R16  100Ω  [R0603]  18.29 51.84 0 top
R17  100kΩ  [R0603]  26.12 21.35 0 top
R18  100Ω  [R0603]  15.24 51.84 0 top
R19  1kΩ  [R0603]  29.09 32.03 0 top
R20  10kΩ  [R0603]  25.05 44.35 90 top
R21  100kΩ  [R0603]  26.05 19.73 0 top
R22  1MΩ  [R0603]  11.59 21.11 90 top
R23  100kΩ  [R0603]  25.99 18.18 0 top
R24  100kΩ  [R0603]  31.96 21.35 0 top
R25  100Ω  [R0603]  11.78 51.25 0 top
R26  100Ω  [R0603]  11.73 52.89 0 top
R27  100Ω  [R0603]  16.26 48.79 90 top
R28  100Ω  [R0603]  17.91 48.79 90 top
R29  100Ω  [R0603]  26.04 32.03 0 top
R30  100Ω  [R0603]  18.17 45.36 90 top
R31  100Ω  [R0603]  16.39 45.36 90 top
R32  1kΩ  [R0603]  13.85 48.03 0 top
R33  1kΩ  [R0603]  14.36 45.36 90 top
R34  100kΩ  [R0603]  26.12 15.51 0 top
R35  10kΩ  [R0603]  5.47 36.98 180 top
R36  1kΩ  [R0603]  8.64 48.16 0 top
R37  1kΩ  [R0603]  10.07 31.96 0 top
R38  1MΩ  [R0603]  7.9 21.11 90 top
R39  100kΩ  [R0603]  26.18 13.99 0 top
R40  100kΩ  [R0603]  26.34 10.33 180 top
R41  1kΩ  [R0603]  10.93 48.92 90 top
R42  100kΩ  [R0603]  26.12 12.46 0 top
R43  100Ω  [R0603]  6.99 31.9 0 top
R44  10kΩ  [R0603]  5.08 42.69 180 top
R45  100kΩ  [R0603]  29.55 8.9 90 top
R46  1MΩ  [R0603]  5.49 21.11 90 top
R47  100kΩ  [R0603]  31.07 8.9 90 top
R48  100kΩ  [R0603]  30.56 12.21 0 top
R49  100kΩ  [R0603]  32.6 8.9 90 top
R50  1kΩ  [R0603]  79.91 7.9 270 top
R51  1kΩ  [R0603]  78.01 7.9 270 top
R52  5.1kΩ  [R0603]  66.83 8.93 90 top
R53  1kΩ  [R0603]  88.29 15.52 90 top
R54  1kΩ  [R0603]  90.07 10.31 90 top
R55  5.1kΩ  [R0603]  65.05 8.93 90 top
R56  1kΩ  [R0603]  89.82 15.52 90 top
R57  1kΩ  [R0603]  14.13 15.65 180 top
R58  1kΩ  [R0603]  10.95 15.65 180 top
R59  100Ω  [R0603]  57.18 14 0 top
R60  10kΩ  [R0603]  75.47 35.08 0 top
R61  10kΩ  [R0603]  73.94 36.73 0 top
R62  1kΩ  [R0603]  57.94 9.68 90 top
R63  10kΩ  [R0603]  76.99 36.73 180 top
R64  1kΩ  [R0603]  79.41 35.97 270 top
R65  10kΩ  [R0603]  82.71 39.78 270 top
R66  10kΩ  [R0603]  49.79 26.57 180 top
R67  10kΩ  [R0603]  46.36 26.32 0 top
RF1  BWSMA-KE-P001  [SMA-SMD_BWSMA-KE-P001]  10.8 57.3 90 top
SCREW1  -  [M3螺丝]  88.68 2.82 0 top
SCREW2  -  [M3螺丝]  88.68 57.05 0 top
SCREW3  -  [M3螺丝]  2.95 2.82 0 top
SCREW4  -  [M3螺丝]  2.95 57.05 0 top
SCREW5  -  [M3螺丝]  45.75 11.33 0 top
SW1  -  [SW-TH_4P-L6.0-W6.0-P3.90-LS6.5]  63.53 56.03 180 bottom
SW2  -  [SW-TH_4P-L6.0-W6.0-P3.90-LS6.5]  72.8 56.03 180 bottom
SW3  SS-12D10L5  [SW-TH_SS-12D10L5]  87.71 30.99 270 bottom
U1  STS40-AD1B-R3  [DFN-4_L1.5-W1.5-P0.8-TL-EP]  45.4 44.4 90 top
U2  SI5351A-B-GTR  [MSOP-10_L3.0-W3.0-P0.50-LS5.0-BL]  46.74 23.4 90 top
U3  SA612AD/01,118  [SO-8_L4.9-W3.9-P1.27-LS5.9-BL]  28.2 40.03 180 top
U4  CW32F030C8T6  [LQFP-48_L7.0-W7.0-P0.50-LS9.0-TL]  47.88 36.63 0 top
U5  SA612AD/01,118  [SO-8_L4.9-W3.9-P1.27-LS5.9-BL]  9.28 39.9 180 top
U6  WSP4056  [SOP-8_L5.1-W3.9-P1.27-LS6.0-BL]  85.37 9.81 90 top
U7  662K.  [SOT-23-3_L2.9-W1.3-P1.90-LS2.4-BR]  59.55 31.29 90 top
U8  WSTDW01  [SOT-23-6_L2.9-W1.6-P0.95-LS2.8-BR]  54.89 10.57 270 top
U9  SX1308  [SOT-23-6_L2.9-W1.6-P0.95-LS2.8-BL]  79.41 40.79 270 top
U10  AO3400A  [SOT-23-3_L3.0-W1.6-P1.90-LS2.8-BR]  53.24 6.13 180 top
U11  AO3400A  [SOT-23-3_L3.0-W1.6-P1.90-LS2.8-BR]  57.31 6.13 180 top
U12  -  [SOP-8_L4.9-W3.9-P1.27-LS6.0-BL]  30.69 16.78 180 top
USB1  TYPE-C16PIN2MD(073)  [USB-C-SMD_TYPE-C-6PIN-2MD-073]  65.75 3.99 0 top
X1  25MHz  [CRYSTAL-SMD_4P-L3.2-W2.5-BL]  52.59 23.4 225 top

## Footprints (pads in the part's own frame, mm; a bottom-side part is the same pattern mirrored in y, then rotated)
BAT-TH_BH-18650-A1AJ005
  round 1.6 hole 1.02: 1(-35,0) 2(35,0)
C0603
  rect 0.8x0.9 smd: 1(-0.7,0) 2(0.7,0)
CRYSTAL-SMD_4P-L3.2-W2.5-BL
  rect 1.4x1.2 smd: 1(-1.1,-0.85) 2(1.1,-0.85) 3(1.1,0.85) 4(-1.1,0.85)
DFN-4_L1.5-W1.5-P0.8-TL-EP
  rect 0.505x0.42 hole 0.305: 1(-0.677,0.4) 2(-0.677,-0.4) 3(0.677,-0.4) 4(0.677,0.4)
  rect 0.4x1.1 hole 0.4: 5(0,0)
FPC-SMD_10P-P1.0_FGS-XJ-H2.0
  rect 0.3x1.25 smd: 1(-4.497,-1.276) 2(-3.498,-1.276) 3(-2.498,-1.276) 4(-1.497,-1.276) 5(-0.497,-1.276) 6(0.502,-1.276) 7(1.502,-1.276) 8(2.503,-1.276) 9(3.502,-1.274) 10(4.503,-1.274)
  rect 1.8x2.2 smd: 11(-6.9,1.276) 12(6.9,1.276)
HDR-TH_1P-V-M_XKB_X4611WV-01I-C28D40
  rect 1.4x1.4 hole 0.9: 1(0,0)
IND-SMD_L6.0-W6.0_SWPA6045S
  rect 2.474x5.02 smd: 1(-2.603,0) 2(2.603,0)
LED-TH_BD3.0-P2.54-FD
  round 1.524 hole 0.914: 1(-1.27,0) 2(1.27,0)
LQFP-48_L7.0-W7.0-P0.50-LS9.0-TL
  oval 1.8x0.28 smd: 1(-4.05,2.75) 2(-4.05,2.25) 3(-4.05,1.75) 4(-4.05,1.25) 5(-4.05,0.75) 6(-4.05,0.25) 7(-4.05,-0.25) 8(-4.05,-0.75) 9(-4.05,-1.25) 10(-4.05,-1.75) 11(-4.05,-2.25) 12(-4.05,-2.75) 25(4.05,-2.75) 26(4.05,-2.25) 27(4.05,-1.75) 28(4.05,-1.25) 29(4.05,-0.75) 30(4.05,-0.25) 31(4.05,0.25) 32(4.05,0.75) 33(4.05,1.25) 34(4.05,1.75) 35(4.05,2.25) 36(4.05,2.75)
  oval 0.28x1.8 smd: 13(-2.75,-4.05) 14(-2.25,-4.05) 15(-1.75,-4.05) 16(-1.25,-4.05) 17(-0.75,-4.05) 18(-0.25,-4.05) 19(0.25,-4.05) 20(0.75,-4.05) 21(1.25,-4.05) 22(1.75,-4.05) 23(2.25,-4.05) 24(2.75,-4.05) 37(2.75,4.05) 38(2.25,4.05) 39(1.75,4.05) 40(1.25,4.05) 41(0.75,4.05) 42(0.25,4.05) 43(-0.25,4.05) 44(-0.75,4.05) 45(-1.25,4.05) 46(-1.75,4.05) 47(-2.25,4.05) 48(-2.75,4.05)
M3螺丝
  round 3.2 hole 3.2: 1(-0.064,0.064)
Mark-Point-1mm
  round 1 smd: 1(0,0)
MSOP-10_L3.0-W3.0-P0.50-LS5.0-BL
  oval 0.28x1.62 smd: 1(-1,-2.11) 2(-0.5,-2.11) 3(0,-2.11) 4(0.5,-2.11) 5(1,-2.11) 6(1,2.11) 7(0.5,2.11) 8(0,2.11) 9(-0.5,2.11) 10(-1,2.11)
Pad_e246
  round 1.2 hole 0.914: 1(0,0)
Pad_e248
  round 1.2 hole 0.914: 1(0,0)
Pad_e588
  rect 3x5 hole 2: 1(0,0)
Pad_e749
  round 2 hole 1: 1(0,0)
Pad_e750
  round 2 hole 1: 2(0,0)
Pad_e1295
  round 2 hole 1: 1(0,0)
Pad_e1581
  round 2 hole 1: 1(0,0)
Pad_e1582
  round 2 hole 1: 2(0,0)
R0603
  rect 0.806x0.864 smd: 1(-0.753,0) 2(0.753,0)
SMA-SMD_BWSMA-KE-P001
  rect 4.8x1.2 smd: 1(0,-2.55) 2(0,2.55) 5(0,0)
  rect 4.8x1.2 smd far side: 3(0,2.55) 4(0,-2.55)
SMA_L4.3-W2.6-LS5.2-RD
  rect 2x2 smd: 1(-2.2,0) 2(2.2,0)
SO-8_L4.9-W3.9-P1.27-LS5.9-BL
  oval 0.574x1.888 smd: 1(-1.905,-2.699) 2(-0.635,-2.699) 3(0.635,-2.699) 4(1.905,-2.699) 5(1.905,2.699) 6(0.635,2.699) 7(-0.635,2.699) 8(-1.905,2.699)
SOP-8_L4.9-W3.9-P1.27-LS6.0-BL
  oval 0.63x1.865 smd: 1(-1.905,-2.683) 2(-0.635,-2.683) 3(0.635,-2.683) 4(1.905,-2.683) 5(1.905,2.683) 6(0.635,2.683) 7(-0.635,2.683) 8(-1.905,2.683)
SOP-8_L5.1-W3.9-P1.27-LS6.0-BL
  oval 0.6x1.52 smd: 1(-1.905,-2.74) 2(-0.635,-2.74) 3(0.635,-2.74) 4(1.905,-2.74) 5(1.905,2.74) 6(0.635,2.74) 7(-0.635,2.74) 8(-1.905,2.74)
SOT-23-3_L2.9-W1.3-P1.90-LS2.4-BR
  rect 1.25x0.7 smd: 1(1,-0.95) 2(1,0.95) 3(-1,0)
SOT-23-3_L3.0-W1.6-P1.90-LS2.8-BR
  rect 1.07x0.532 smd: 1(1.135,-0.95) 2(1.135,0.95) 3(-1.135,0)
SOT-23-6_L2.9-W1.6-P0.95-LS2.8-BL
  rect 0.532x1.072 smd: 1(-0.95,-1.149) 2(0,-1.149) 3(0.95,-1.149) 4(0.95,1.149) 5(0,1.149) 6(-0.95,1.149)
SOT-23-6_L2.9-W1.6-P0.95-LS2.8-BR
  rect 1.1x0.6 smd: 1(1.35,-0.95) 2(1.35,0) 3(1.35,0.95) 4(-1.35,0.95) 5(-1.35,0) 6(-1.35,-0.95)
SW-TH_4P-L6.0-W6.0-P3.90-LS6.5
  round 2 hole 1.2: 1(-3.25,2.25) 2(3.25,2.25) 3(-3.25,-2.25) 4(3.25,-2.25)
SW-TH_SS-12D10L5
  oval 2x3 hole 1.3x2: 1(-4.7,0) 2(0,0) 3(4.7,0)
USB-C-SMD_TYPE-C-6PIN-2MD-073
  rect 0.6x1.1 smd: 1(-3.2,2.375) 2(-2.4,2.375) 11(2.4,2.375) 12(3.2,2.375)
  rect 0.3x1.1 smd: 3(-1.75,2.375) 4(-1.25,2.375) 5(-0.75,2.375) 6(-0.25,2.375) 7(0.25,2.375) 8(0.75,2.375) 9(1.25,2.375) 10(1.75,2.375)
  oval 1.2x2 hole 0.6x1.5: 13(-4.325,1.825) 14(4.325,1.825)
  oval 1.2x1.8 hole 0.6x1.2: 13(-4.325,-2.375) 14(4.325,-2.375)

## Nets
As in the schematic, except:
+3.3V: C1.2 C10.2 C14.2 C18.2 C26.1 C29.1 C31.2 C33.2 FPC1.5 NOREF#4.1 R1.1 R2.1 R57.1 R66.1 R67.1 U1.3 U2.1 U2.7 U4.1 U4.9 U4.24 U4.48 U7.2 U12.8
GND: C1.1 C3.1 C6.1 C9.1 C10.1 C11.1 C13.1 C14.1 C17.1 C18.1 C20.1 C21.1 C25.1 C26.2 C27.1 C28.1 C29.2 C30.1 C31.1 C34.1 C36.2 C37.1 C38.1 C39.1 C40.1 FPC1.4 FPC1.10 FPC1.11 FPC1.12 H2.1 NOREF.1 NOREF#2.1 NOREF#5.1 NOREF#7.1 NOREF#8.2 R12.2 R13.1 R14.1 R15.1 R29.1 R30.1 R31.1 R33.1 R36.1 R43.1 R52.2 R53.2 R55.2 R56.2 R58.2 R62.1 R64.2 RF1.1 RF1.2 RF1.3 RF1.4 SCREW1.1 SCREW2.1 SCREW3.1 SCREW4.1 SCREW5.1 SW1.1 SW1.2 SW2.1 SW2.2 U1.4 U1.5 U2.8 U3.3 U4.8 U4.23 U4.47 U5.3 U6.1 U6.3 U7.1 U9.2 U11.2 U12.4 USB1.1 USB1.12 USB1.13 USB1.14 X1.2 X1.4
BT+: BT1.2 C28.2 NOREF#3.2 NOREF#6.1 R59.2 SW3.3 U6.5

Pads without a net: MARK1 1; MARK2 1; U3 7; U4 2 3 4 6 7 12 15 16 17 18 19 20 21 22 25 26 27 28 29 30 31 32 33 35 36; U5 7; U8 4; U9 6; USB1 3 5 6 7 8 9

## Via types
v1: diameter 0.61, hole 0.305, Top Layer to Bottom Layer, 135 vias

## Routing (per net, layer and track width the routed paths; a pad name or vN(x,y) marks a point on that pad's centre or on a via; arc(x,y) is an arc through that point)
+1.65V: length 21.6
  Top Layer w0.63: R8.1 v1(16.92,21.49) ; v1(10.44,20.35) 11.58,20.35 R22.1 11.8,20.15 14.18,20.15 v1(14.64,20.6) ; R38.1 8.54,20.36
  Top Layer w0.8: 12.44,15.65 12.54,15.75 12.54,17.55 C33.1 ; 12.44,15.65 R58.1 ; 12.44,15.65 R57.2 ; 12.54,20.15 12.54,18.12 11.98,17.55 11.78,17.55 C34.2 ; R46.1 R38.1
  Bottom Layer w0.63: v1(14.64,20.6) 15.52,21.49 v1(16.92,21.49) ; v1(10.44,20.35) 10.36,20.43 v1(8.56,20.43)
+3.3V: length 168.9
  Top Layer w0.254: U1.3 45.8,45.57 45.47,45.9 42.29,45.9 41.85,45.46 41.85,45.2 41.92,45.13 R2.1 ; 46.17,23.9 46.17,25.75 R67.1 45.61,27.65 40.16,33.1 40.16,34.71 40.24,34.79 C18.2 41.49,35.38 U4.9 46.35,35.38 47.75,36.78 ; 46.17,23.9 46.74,23.9 ; 46.17,23.9 44.63,23.9 ; C14.2 43.37,41.52 41.92,42.97 R1.1 R2.1 ; 44.93,39.59 47.75,36.78 ; 44.93,39.59 44.72,39.38 U4.1 ; 44.93,39.59 45.12,39.78 45.12,40.67 U4.48 ; 47.75,36.78 50.63,33.89 U4.24 50.65,32.56 50.65,32.3 50.83,32.12 51.82,32.12 ; R66.1 53.52,29.55 53.52,32.17 ; R2.1 40.39,44.89 40.03,45.24 40.03,47.78 40.67,48.41 45.75,48.41 45.93,48.59 45.93,51.98 C29.1 45.75,52.16 45.75,52.61 45.1,53.26 FPC1.5 ; U2.1 48.85,21.75 48.4,21.11 C1.2
  Top Layer w0.508: 46.74,23.9 47,23.65 47,20.92 C1.2 48.86,20.8 50.7,18.95 v1(51.21,18.95) 54.64,18.95 57.31,21.62 57.31,31 NOREF#4.1
  Top Layer w0.63: 33.93,11.91 33.93,11.09 34.57,10.44 34.57,6.5 32.92,4.85 21.62,4.85 16.29,10.19 v1(16.29,11.84) ; 33.93,11.91 C10.2 ; 33.93,11.91 34.11,12.09 41.05,12.09 44.61,15.65 50.19,15.65 v1(50.96,16.41) ; v1(16.16,15.39) 15.91,15.65 R57.1 ; NOREF#4.1 U7.2 C31.2 ; 53.52,32.17 51.82,32.12
  Top Layer w0.7: 44.93,39.59 44.93,39.77 C14.2
  Top Layer w0.8: C33.2 14.95,15.72 R57.1 ; C10.2 33.82,14.1 U12.8
  Bottom Layer w0.63: v1(16.29,11.84) v1(16.16,15.39) ; v1(50.96,16.41) v1(51.21,18.95)
+4.5V: length 107.8
  Top Layer w0.508: v1(13.24,33.05) 13.24,35.08 12.48,35.84 12.48,37.07 C17.2 ; 70.96,38.25 70.96,33.87 70.9,33.81 v1(70.9,32.03) ; 33.21,29.87 v1(33.21,31.02) ; 33.21,29.87 32.8,29.87 31.91,28.98 24.03,28.98 22.25,30.76 v1(13.24,30.76) ; 33.21,29.87 37.62,25.46 37.62,21.24 41.43,17.43 58.32,17.43 v1(70.9,30) ; C9.2 31.56,34.82 v1(33.21,33.17)
  Top Layer w0.63: C17.2 11.28,37.11 U5.8 ; C9.2 31.34,37.33 U3.8
  Top Layer w0.8: D1.1 73.57,39.98 C38.2 70.96,39.95 70.96,38.25 72.49,36.73 R61.1 73.18,36.72 73.18,35.46 73.56,35.08 R60.1
  Bottom Layer w0.508: v1(33.21,31.02) v1(33.21,33.17) ; v1(70.9,32.03) v1(70.9,30) ; v1(13.24,30.76) v1(13.24,33.05)
GND: length 134.4
  Top Layer w0.254: U2.8 46.11,23.4 v1(46.11,23.06) v1(46.11,22.38) ; C18.1 41.2,35.88 U4.8 45.16,35.88 v1(45.61,36.33) v1(46.13,36.86) ; v1(48.04,34.57) v1(48.82,34.57) 49.31,34.57 50.13,33.75 U4.23 50.13,31.46 50.83,30.76 51.78,30.76 C26.2 ; 44.41,52.1 44.1,52.41 44.1,54.15 ; v1(47.91,38.64) v1(47.08,38.64) 46.65,38.64 45.63,39.65 U4.47
  Top Layer w0.508: v1(46.87,18.47) 46.87,18.47 46.87,19.39 ; R12.2 v1(41.05,46.92) ; FPC1.4 v1(44.1,55.27) ; v1(85.63,37.62) v1(85.63,38.32) C40.1 C39.1 ; v1(65.05,10.61) R55.2 ; C10.1 v1(36.35,13.98) ; USB1.12 69.53,6.37 USB1.14 ; U9.2 v1(77.21,40.79) v1(76.48,40.79) ; 59.53,5.18 59.97,5.62 59.97,6.9 R62.1 ; 59.53,5.18 U11.2 ; 59.53,5.18 60.1,5.18 USB1.13 61.97,6.37 USB1.1 ; C21.1 v1(28.1,8.16) ; v1(66.83,10.61) R52.2
  Top Layer w0.63: v1(60.23,36.48) v1(60.2,35.62) C31.1 U7.1 C30.1 ; v1(4.58,32.69) C20.1 ; R58.2 10.25,15.7 C34.1 v1(10.25,18.41) v1(10.25,19.08) ; v1(15.4,37.11) v1(14.66,37.11) C17.1 ; v1(26.45,49.68) v1(27.29,49.68) v1(28.06,49.68) R15.1 ; C9.1 v1(33.86,37.11) v1(34.57,37.11) ; v1(28.6,21.36) 28.79,21.18 v1(28.79,20.69) U12.4 ; C6.1 24.48,33.68 v1(23.4,33.68) ; C13.1 23.4,40.22 ; 24.54,32.03 v1(24.29,32.03) ; 24.54,32.03 24.55,32.03 ; 24.54,32.03 25.28,32.03 R29.1 ; FPC1.10 FPC1.12 ; U5.3 v1(8.64,41.34) v1(8.64,40.67) ; v1(27.56,40.67) v1(27.56,41.39) 27.56,42.73 ; v1(16.41,42.06) v1(16.4,42.89) R31.1 ; v1(5.11,31.9) R43.1 ; v1(6,39.58) v1(5.38,39.58) C25.1 ; C14.1 v1(41.05,40.54) ; R36.1 v1(6.79,48.16) ; 6.79,48.16 v1(6.07,48.16) v1(5.24,48.16) ; 38.32,53.49 FPC1.11
  Top Layer w0.8: SW2.1 SW2.2 ; NOREF.1 85.37,7.46 84.17,6.25 ; NOREF.1 85.37,12.92 C28.1 ; NOREF.1 87.15,7.9 U6.1 ; NOREF.1 86.14,10.44 U6.3 ; R30.1 R31.1 R33.1 ; R64.2 v1(79.41,34.17) v1(79.41,33.56) ; v1(89.19,17.81) v1(89.19,17.13) 89.19,16.4 89.06,16.28 ; 89.06,16.28 R53.2 ; 89.06,16.28 R56.2 ; v1(69.56,36.48) v1(69.56,37.1) C37.1 69.53,38.29 C38.1 ; v1(32.8,23.65) 33.17,24.02 33.17,25.41 ; R14.1 R15.1 R13.1 C11.1 ; SW1.2 SW1.1
  vias: v1(1.81,46.51) v1(2.57,49.05) v1(4.35,45.75) v1(4.86,50.83) v1(6.38,53.37) v1(8.03,56.29) v1(8.03,55.38) v1(8.25,58.42) v1(8.25,57.3) v1(9.68,28.73) v1(11.84,28.6) v1(13.24,55.53) v1(13.36,58.96) v1(13.36,57.95) v1(13.35,56.53) v1(15.02,40.41) v1(15.31,28.6) v1(16.79,38.38) v1(17.05,40.67) v1(17.3,55.4) v1(18.32,41.94) v1(18.7,58.07) v1(20.35,44.73) v1(20.6,43.21) v1(21.11,46) v1(21.37,56.67) v1(21.87,58.7) v1(21.87,47.27) v1(22.13,48.54) v1(22.38,22.89) v1(22.38,20.86) v1(22.64,50.07) v1(23.18,40.22) v1(24.41,57.69) v1(28.22,57.94) v1(30,56.92) v1(30.64,35.46) v1(31.15,33.43) v1(32.29,58.07) v1(33.17,24.23) v1(34.07,49.3) v1(34.07,47.78) v1(34.07,46.26) v1(34.07,44.44) v1(34.07,39.14) v1(34.32,41.94) v1(46.51,34.57) v1(47.78,35.5) v1(48.29,37.62) v1(49.56,38.25) v1(49.66,36.33)
VCC: length 53.1
  Top Layer w0.508: U9.5 82.44,40.79 R65.1 82.71,45.47 L1.2
  Top Layer w0.63: U7.3 C30.2 SW3.2
  Top Layer w0.8: R65.1 85.57,40.53 C40.2 C39.2 87.42,40.49 88.76,40.49 89.56,39.69 89.56,37.54 SW3.1
  Top Layer w2: SW3.2 SW3.1
BT+: length 46.6
  Top Layer w0.508: NOREF#6.1 62.25,18.32 R59.2
  Top Layer w0.8: BT1.2 81,11.71 U6.5 82.63,13.23 C28.2
  Top Layer w2: NOREF#6.1 80.8,19.38 SW3.3 ; BT1.2 NOREF#3.2
  Bottom Layer w2: NOREF#3.2 80.75,18.26 NOREF#6.1
BT-: length 62.5
  Top Layer w0.508: U8.6 53.31,11.92 ; 53.31,11.92 50.58,9.19 50.58,5.75 51.17,5.15 51.89,5.15 51.91,5.18 U10.2 52.11,4.35 49.94,2.19 13.62,2.19 10.75,5.06 BT1.1 ; 53.31,11.92 C32.1
PA0_ADC0: length 20.9
  Top Layer w0.254: U4.10 42.5,34.88 41.43,33.81 v1(41.43,33.43)
  Top Layer w0.63: U12.1 32.71,19.58 R24.2 34.7,23.34 v1(34.7,26.82)
  Bottom Layer w0.63: v1(41.43,33.43) 34.83,26.82 v1(34.7,26.82)
PA1_ADC1: length 28.5
  Top Layer w0.254: v1(42.57,32.54) 42.57,34.13 42.83,34.38 U4.11
  Top Layer w0.63: R48.2 31.32,14.09 U12.7 31.33,15.78 31.77,16.22 32.48,16.22 36.22,19.97 36.22,25.05 v1(36.1,25.17)
  Bottom Layer w0.63: v1(36.1,25.17) 36.1,26.06 v1(42.57,32.54)
PA13_SWDIO: length 7.6
  Top Layer w0.254: U4.34 53.37,38.38 54.13,39.14 54.13,41.3 55.58,42.75 H3.1
PA14_SWCLK: length 8.1
  Top Layer w0.254: H1.1 54.41,45.14 50.63,41.36 U4.37
PA15_SPI1_CS_LCD_A0: length 14.9
  Top Layer w0.254: FPC1.8 48.11,54.14 48.11,53.04 48.86,52.29 49.88,52.29 50.13,52.04 U4.38
PB3_SPI1_SCK: length 15
  Top Layer w0.254: U4.39 49.63,51.59 49.38,51.84 48.54,51.84 47.08,53.3 47.08,54.14 FPC1.7
PB4_LCD_RST: length 13.6
  Top Layer w0.254: v1(49.1,53.19) FPC1.9 ; U4.40 49.13,51 v1(48.93,51.21)
  Bottom Layer w0.254: v1(48.93,51.21) v1(49.1,53.19)
PB5_SPI1_MOSI: length 14.5
  Top Layer w0.254: U4.41 48.63,49.6 46.89,51.34 46.89,52.48 46.13,53.24 46.13,54.12 FPC1.6
SI5351_CLK2_MCU_OSC_IN: length 21.6
  Top Layer w0.254: U4.5 38.65,37.38 37.88,36.6 37.88,33.3 43.72,27.46 43.72,24.72 43.9,24.54 44.49,24.54 U2.6
SI5351_SCL_PA4_SCL: length 11
  Top Layer w0.254: 48.85,23.9 47.64,23.9 47.12,24.42 R67.2 47.15,26.35 47.15,27.46 45.13,29.48 U4.13
SI5351_SDA_PA5_SDA: length 9.7
  Top Layer w0.254: U2.5 48.85,26.39 R66.2 48.8,26.81 48.8,27.46 45.63,30.63 U4.14
$1N13991: length 4.1
  Top Layer w0.508: U11.3 U10.3
$1N14154: length 3.7
  Top Layer w0.508: U10.1 53.43,7.08 53.94,7.59 U8.1
$1N14198: length 2.3
  Top Layer w0.508: U8.3 55.84,7.41 U11.1
$1N14351: length 4
  Top Layer w0.508: R62.2 57.93,10.42 55.25,10.42 54.89,10.06 U8.2
$1N15015: length 2.1
  Top Layer w0.8: U6.2 89.68,9.17 R54.1
$1N15845: length 2.9
  Top Layer w0.254: U6.7 81.69,9.17 81.17,8.66 R50.1
$1N15894: length 5.7
  Top Layer w0.254: R51.1 78.21,8.86 78.21,9.5 78.39,9.68 81.86,9.68 81.93,9.75 81.94,9.75 U6.6
$1N16826: length 2
  Top Layer w0.254: USB1.4 64.55,7.52 R55.1
$1N16875: length 2
  Top Layer w0.254: USB1.10 67.47,7.14 67.09,7.52 R52.1
$1N19532: length 3.9
  Top Layer w0.508: R59.1 54.71,14 54.71,13.3 54.89,13.11 U8.5
$1N165486: length 5.3
  Top Layer w0.8: R54.2 90.07,14.51 R56.1 R53.1
$1N167672: length 64.7
  Top Layer w0.508: USB1.2 63.35,10.52 64.42,11.58 67.47,11.58 68.15,10.9 USB1.11
  Top Layer w0.8: U6.4 88.11,12.78 85.12,15.78 72.17,15.78 67.72,11.33 ; 68.15,9 70.31,9 LED2.1 78.26,1.04 83.22,1.04 83.78,1.61 83.78,2.64 LED1.1 83.72,3.71 82.71,4.73 82.71,6.19 C27.2 82.77,7.77 U6.8
$1N179497: length 5
  Top Layer w0.8: LED1.2 81.18,4.73 79.91,6 R50.2
$1N179538: length 5
  Top Layer w0.8: LED2.2 79.15,4.47 77.88,5.74 77.88,7.02 R51.2
$1N206778: length 9.1
  Top Layer w0.254: 43.43,46.92 45.72,46.92 47.13,45.51 U4.44
$1N234129: length 12.2
  Top Layer w0.8: SW1.3 SW1.4 60.28,55.73 58.07,57.94 R6.1
$1N234138: length 25.1
  Top Layer w0.8: R7.1 57.94,55.77 57.94,52.1 59.09,50.95 68.36,50.95 69.55,52.15 SW2.4 SW2.3
$1N234147: length 47.2
  Top Layer w0.254: v1(45.12,49.18) 39.27,49.18 36.73,51.72 36.73,59.08 36.99,59.34 54.52,59.34 R6.2 ; U4.43 47.63,48.34 v1(46.8,49.18)
  Bottom Layer w0.254: v1(45.12,49.18) v1(46.8,49.18)
$1N234151: length 47.8
  Top Layer w0.254: R7.2 55.02,56.29 54.51,56.8 54.51,58.57 54.33,58.75 37.67,58.75 37.42,58.5 37.42,51.8 39.15,50.07 v1(45.12,50.07) ; U4.42 48.13,49.46 47.53,50.07 v1(46.79,50.07)
  Bottom Layer w0.254: v1(45.12,50.07) v1(46.79,50.07)
$1N252869: length 2.3
  Top Layer w0.254: C36.1 39.72,53.43 39.91,53.24 40.92,53.24 41.1,53.41 FPC1.1
$1N252872: length 2.4
  Top Layer w0.254: FPC1.2 42.1,53.4 41.24,52.54 C35.2
$1N252875: length 2.2
  Top Layer w0.254: FPC1.3 43.1,52.56 C35.1
$1N306266: length 7.7
  Top Layer w0.63: R26.1 RF1.5
  Top Layer w0.8: R26.1 11.02,52.85 R25.1 R41.2
$1N307798: length 6.4
  Top Layer w0.254: U1.1 44.73,43.72 44.32,44.12 44.32,44.63 44.15,44.81 43.5,44.81 43.43,44.89 ; U4.46 46.13,42.06 45.85,42.35 v1(44.96,42.35)
  Bottom Layer w0.254: U1.1 44.96,43.68 v1(44.96,42.35)
$1N307806: length 6
  Top Layer w0.254: 43.43,43.36 43.81,42.98 45.72,42.98 45.8,43.06 ; U1.2 45.8,43.06 ; 45.8,43.06 46.63,42.23 U4.45
$1N312774: length 6.7
  Top Layer w0.8: R31.2 R30.2 ; 17.01,48.04 R27.1 R32.2 ; 17.01,48.04 R28.1 ; 17.01,48.04 17.02,46.38
$1N315798: length 4.9
  Top Layer w0.8: R33.2 C16.1 R32.1
$1N315843: length 3.6
  Top Layer w0.8: C22.1 R36.2 R41.1
$1N315966: length 2.3
  Top Layer w0.63: U5.1 11.18,44.03 C16.2
$1N315972: length 2.2
  Top Layer w0.63: C22.2 9.91,44.41 U5.2
$1N316211: length 10.1
  Top Layer w0.508: L1.1 78.26,44.71 U9.1
  Top Layer w0.8: L1.1 76.53,46.44 74.26,46.44 73.69,45.87 D1.2
$1N316578: length 1.5
  Top Layer w0.8: R61.2 R63.2
$1N316588: length 7.6
  Top Layer w0.508: U9.3 78.26,36.83 78.35,36.73
  Top Layer w0.8: R60.2 76.99,35.08 77.75,35.83 R63.1 79.4,36.73 R64.1
$1N317006: length 2.5
  Top Layer w0.508: U9.4 80.86,39.84 81.69,39.02 82.7,39.02 R65.2
$1N317029: length 8.5
  Top Layer w0.8: R28.2 R27.2 14.74,50.44 14.48,50.82 R18.1 12.59,51.84 12.53,51.9 ; 12.53,51.9 R25.2 ; 12.53,51.9 12.53,52.85 R26.2
$1N317034: length 4.8
  Top Layer w0.254: 44.63,22.9 42.69,22.9 41.05,24.54 C4.2
$1N317145: length 1.5
  Top Layer w0.8: R16.1 R18.2
$1N317149: length 45.3
  Top Layer w0.63: C4.1 41.05,27.46 36.61,31.9 36.61,50.32 32.33,54.6 R10.2 R16.2
$1N317264: length 2.1
  Top Layer w0.63: U5.6 8.61,37.17 C23.1
$1N317334: length 3.3
  Top Layer w0.8: 8.58,31.93 R43.2 ; 8.58,31.93 R37.1 ; 8.58,31.93 C23.2
$1N317556: length 7
  Top Layer w0.8: C8.1 R13.2 R15.2 R14.2 30.32,53.05 R10.1
$1N317854: length 2.1
  Top Layer w0.63: C8.2 30.48,43.11 U3.1
$1N317860: length 2
  Top Layer w0.63: C11.2 28.83,44.41 U3.2
$1N318018: length 3.4
  Top Layer w0.8: C15.2 27.39,32.03 ; 27.39,32.03 R29.2 ; 27.39,32.03 R19.1
$1N318020: length 2.2
  Top Layer w0.63: 27.56,37.33 27.56,35.52 C15.1
$1N318025: length 34.7
  Top Layer w0.508: 31.53,32.03 R19.2 ; 31.82,32.03 31.91,31.94 31.91,30.89 31.4,30.38 24.29,30.38 22.71,31.96 R37.2
  Top Layer w0.63: 31.53,32.03 33.63,32.03 C2.1
$1N318503: length 10.9
  Top Layer w0.63: U12.3 30.06,21.69 28.75,23 R11.2
  Top Layer w0.8: 26.87,25.5 26.87,24.66 R9.2 26.93,23.06 R11.2 ; 26.87,25.5 26.96,25.41 R4.1 ; 26.87,25.5 R3.2
$1N318532: length 11.2
  Top Layer w0.63: R24.1 31.33,21.23 U12.2 31.33,18.37 30.76,17.81 27.11,17.81 R23.2 26.8,18.23 R21.2 26.87,19.8 R17.2
$1N318560: length 7.7
  Top Layer w0.63: U12.6 30.06,12.45 R48.1 29.81,9.92 R45.2 R47.2 R49.2
$1N318595: length 7.2
  Top Layer w0.63: R40.1 27.1,12.23 R42.2 26.93,12.52 R39.2 ; R39.2 28.68,13.99 U12.5 ; R39.2 26.93,15.45 R34.2
$1N319019: length 33
  Top Layer w0.63: R39.1 9.31,13.99 8.03,15.27 8.03,18.32 9.43,19.71 9.43,22 8.98,22.44 8.35,22.44 7.9,22 ; R39.1 25.42,12.52 R42.1 ; R39.1 25.37,14.05 R34.1
  Top Layer w0.8: C19.2 R38.2
$1N319032: length 43.1
  Top Layer w0.63: R49.1 R47.1 R45.1 29.55,7.57 28.35,6.38 24.67,6.38 18.06,12.98 8.67,12.98 3.59,18.06 3.59,21.24 4.21,21.86 R46.2
  Top Layer w0.8: C24.2 5.36,21.99 R46.2
$1N319066: length 22.6
  Top Layer w0.63: R21.1 25.19,19.84 16.92,19.84 13.24,23.52 ; R21.1 25.3,18.23 R23.1 ; R21.1 25.37,19.8 R17.1
  Top Layer w0.8: C12.2 14.32,24.6 R22.2
$1N319081: length 11.5
  Top Layer w0.63: R8.2 20.09,24.34 C5.2
  Top Layer w0.8: R9.1 25.37,24.66 R3.1 ; R9.1 25.42,24.6 C5.2 ; R9.1 25.42,23.06 R11.1
$1N319118: length 2.2
  Top Layer w0.63: C21.2 25.59,8.24 R40.2
$1N319219: length 1.7
  Top Layer w0.8: R4.2 C3.2
$1N319491: length 17.8
  Top Layer w0.63: 23.02,37.16 23.02,37.62 23.77,38.37 R5.2 ; 23.02,37.16 22.72,36.86 22,36.86 21.56,36.41 v1(21.56,33.05) ; 23.02,37.16 23.02,36.22 24.09,35.14 C6.2 ; C5.1 20.35,27.59 21.49,28.73 v1(21.49,29.11)
  Bottom Layer w0.63: v1(21.56,33.05) 21.56,29.17 v1(21.49,29.11)
$1N319530: length 25.7
  Top Layer w0.63: 23.71,42.93 23.71,42.32 C13.2 ; 23.71,42.93 23.61,42.83 23.02,42.83 20.22,40.03 v1(20.22,33.17) ; 23.71,42.93 23.71,44.66 24.16,45.1 R20.2 ; C12.1 19.4,29.24 v1(20.22,29.24)
  Bottom Layer w0.63: v1(20.22,29.24) v1(20.22,33.17)
$1N319569: length 14.3
  Top Layer w0.63: R35.2 4.71,35.28 C20.2 4.44,35.27 3.65,35.27 3.2,34.83 3.2,31.65 7.9,26.95 C19.1
$1N319608: length 19.6
  Top Layer w0.63: C24.1 5.36,27.21 2.32,30.25 2.32,40.54 2.76,40.99 4.19,40.99 C25.2 4.33,41.12 R44.2
$1N319612: length 2.1
  Top Layer w0.63: U3.5 25.83,36.87 R5.1
$1N319619: length 1.8
  Top Layer w0.63: U3.4 26.29,43.11 25.8,43.6 R20.1
$1N319627: length 1.2
  Top Layer w0.63: U5.5 6.44,37.2 R35.1
$1N319640: length 1.6
  Top Layer w0.63: U5.4 7.28,42.69 R44.1
$1N320395: length 3.9
  Top Layer w0.254: 48.85,22.9 49.79,22.89 50.3,22.38 50.81,22 51.32,21.87 X1.3
$1N320402: length 4.4
  Top Layer w0.254: X1.1 51.57,24.67 50.81,24.29 49.92,23.4 U2.3
$1N320534: length 6.9
  Top Layer w0.254: C2.2 39.15,24.54 41.29,22.4 U2.10

## Copper pours and planes (outline as drawn; the poured copper is in the pictures)
GND on Top Layer: 45.13,39.38 50.63,39.38 50.63,33.89 45.13,33.89
GND on Top Layer: 0,60 37.66,60 37.66,28 0,28
GND on Bottom Layer: 0,60 91.5,60 91.5,0 0,0
BT+ on Top Layer: 79.66,12.54 81.84,12.54 81.84,10.37 79.66,10.37
